# EAGLE schematic SPU (EAGLE 9.6.2), part 1 of 2

## Sheet 1 of 8: Smarfusion2
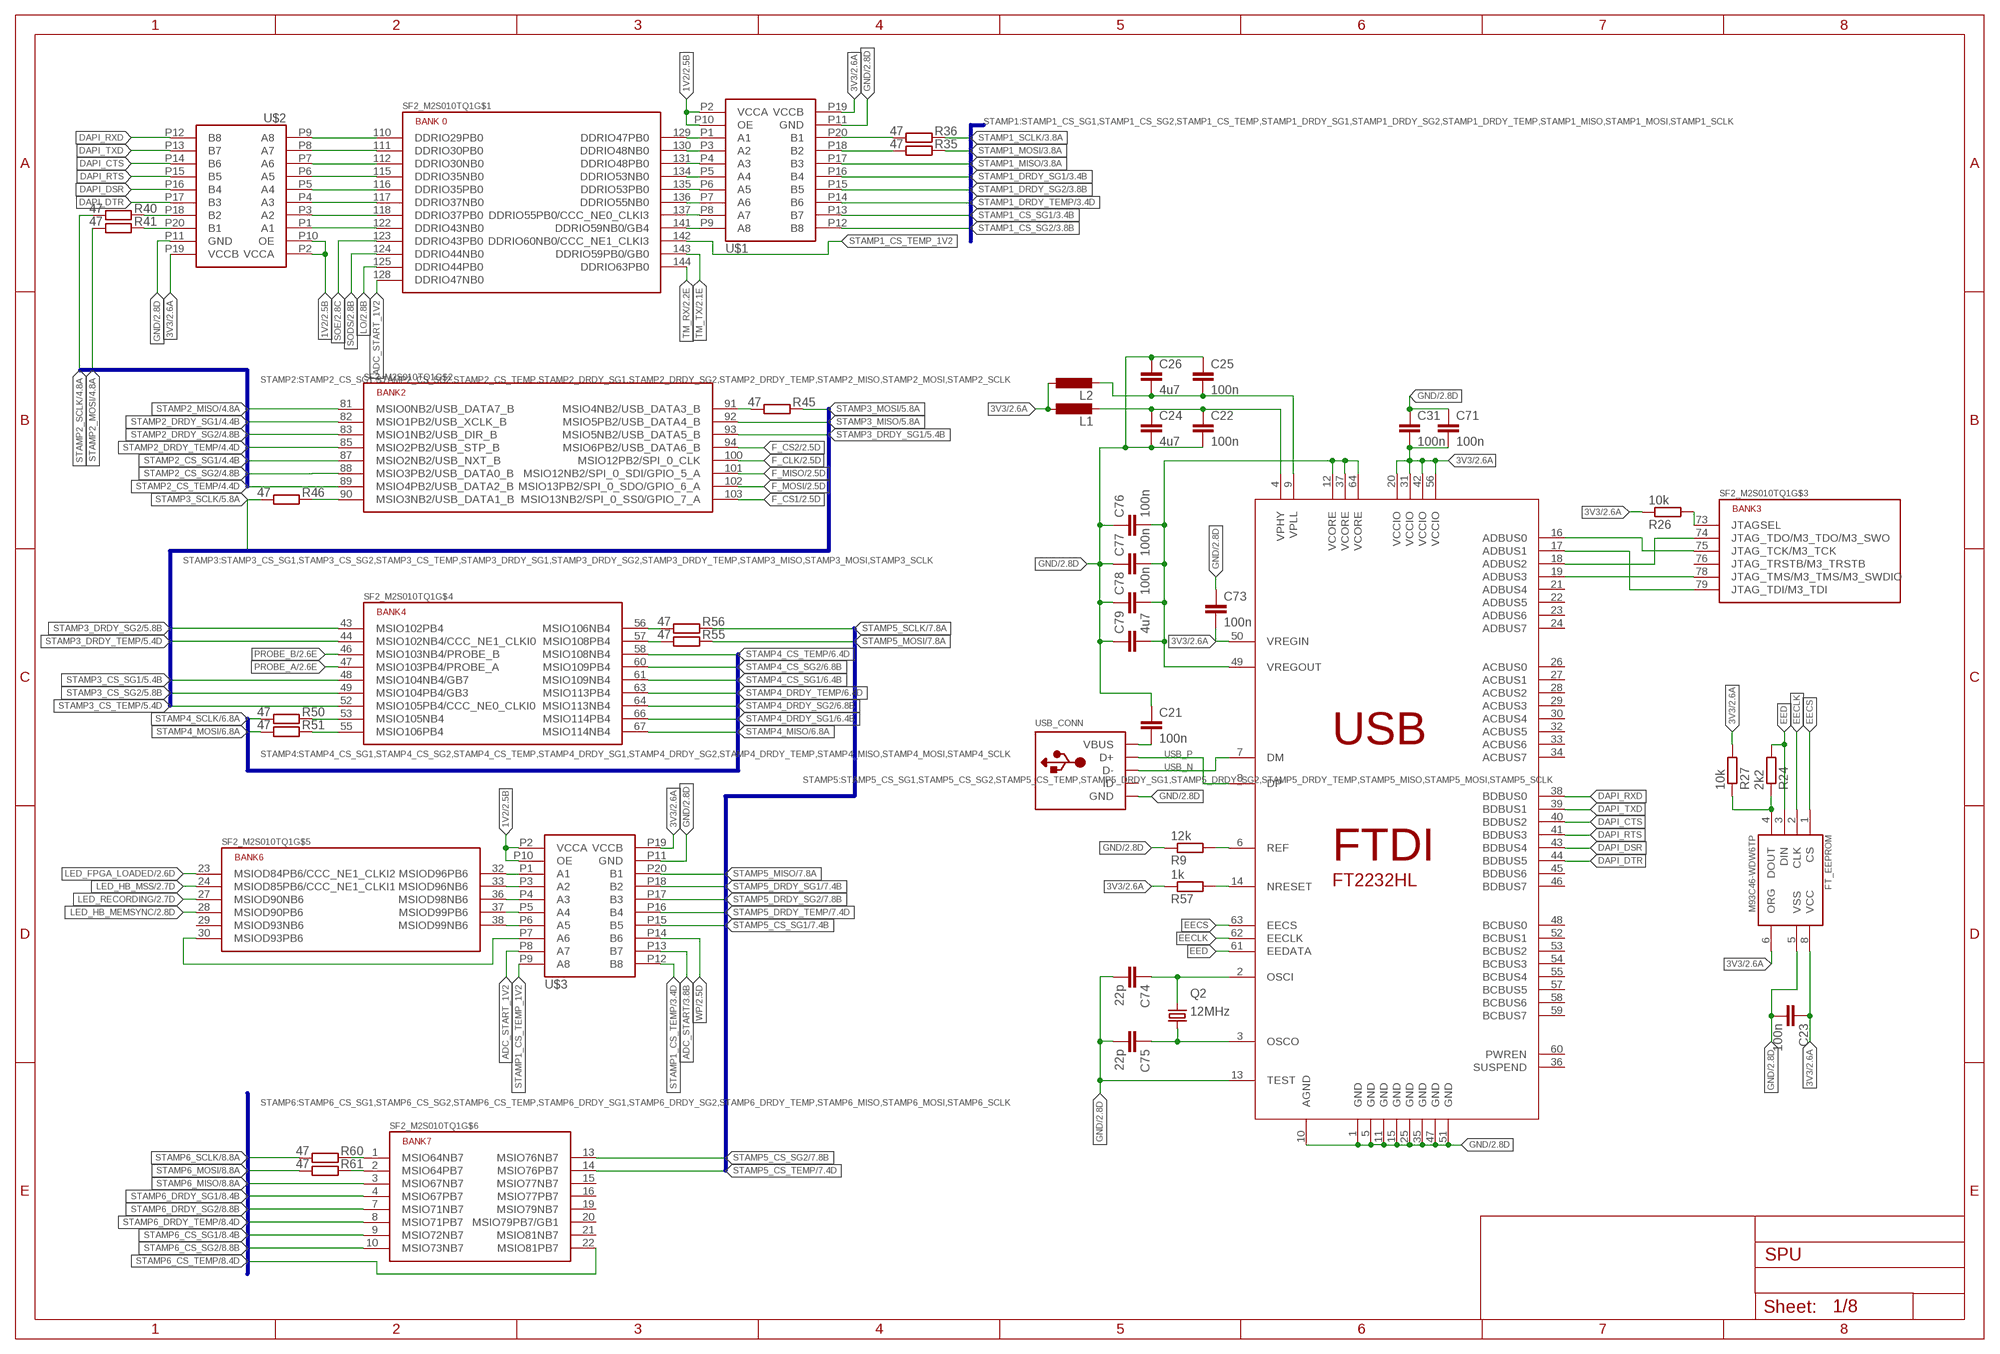
[diagram p0: schematic, sheet 1]

### Parts
C21  100n  C-EUC0805  [C0805]
C22  100n  C-EUC0805  [C0805]
C23  100n  C-EUC0805  [C0805]
C24  4u7  C-EUC0805  [C0805]
C25  100n  C-EUC0805  [C0805]
C26  4u7  C-EUC0805  [C0805]
C31  100n  C-EUC0805  [C0805]
C71  100n  C-EUC0805  [C0805]
C73  100n  C-EUC0805  [C0805]
C74  22p  C-EUC0805  [C0805]
C75  22p  C-EUC0805  [C0805]
C76  100n  C-EUC0805  [C0805]
C77  100n  C-EUC0805  [C0805]
C78  100n  C-EUC0805  [C0805]
C79  4u7  C-EUC0805  [C0805]
FT_EEPROM  M93C46-WDW6TP  [TSSOP-8]
L1  L-EUL1812  [L1812]
L2  L-EUL1812  [L1812]
Q2  12MHz  CRYSTALHC49UP  [HC49UP]
R9  12k  R-EU_R0805  [R0805]
R24  2k2  R-EU_R0805  [R0805]
R26  10k  R-EU_R0805  [R0805]
R27  10k  R-EU_R0805  [R0805]
R35  47  R-EU_R0805  [R0805]
R36  47  R-EU_R0805  [R0805]
R40  47  R-EU_R0805  [R0805]
R41  47  R-EU_R0805  [R0805]
R45  47  R-EU_R0805  [R0805]
R46  47  R-EU_R0805  [R0805]
R50  47  R-EU_R0805  [R0805]
R51  47  R-EU_R0805  [R0805]
R55  47  R-EU_R0805  [R0805]
R56  47  R-EU_R0805  [R0805]
R57  1k  R-EU_R0805  [R0805]
R60  47  R-EU_R0805  [R0805]
R61  47  R-EU_R0805  [R0805]
SF2_M2S010TQ1  SF2_M2S010TQ144  [TQFP144]
U$1  NXB0108PWJ  [TSSOP-20]
U$2  NXB0108PWJ  [TSSOP-20]
U$3  NXB0108PWJ  [TSSOP-20]
USB  FT2232HL  [LQFP64]
USB_CONN  USBMINIB  [USB-MINIB]

### Nets
1V2: U$1.P2(VCCA) U$1.P10(OE) U$2.P2(VCCA) U$2.P10(OE) U$3.P2(VCCA) U$3.P10(OE) ; also sheet 2
3V3: C23.1 C31.2 C71.2 C73.2 FT_EEPROM.6(ORG) FT_EEPROM.8(VCC) L1.1 L2.1 R26.1 R27.2 R57.1 U$1.P19(VCCB) U$2.P19(VCCB) U$3.P19(VCCB) USB.20(VCCIO) USB.31(VCCIO) USB.42(VCCIO) USB.50(VREGIN) USB.56(VCCIO) ; also sheet 2,3,4,5,6,7,8
ADC_START: U$3.P13(B7) ; also sheet 3,4,5,6,7,8
ADC_START_1V2: SF2_M2S010TQ1.128(DDRIO47NB0) U$3.P8(A7)
DAPI_CTS: U$2.P14(B6) USB.40(BDBUS2)
DAPI_DSR: U$2.P16(B4) USB.43(BDBUS4)
DAPI_DTR: U$2.P17(B3) USB.44(BDBUS5)
DAPI_RTS: U$2.P15(B5) USB.41(BDBUS3)
DAPI_RXD: U$2.P12(B8) USB.38(BDBUS0)
DAPI_TXD: U$2.P13(B7) USB.39(BDBUS1)
EECLK: FT_EEPROM.2(CLK) USB.62(EECLK)
EECS: FT_EEPROM.1(CS) USB.63(EECS)
EED: FT_EEPROM.3(DIN) R24.2 USB.61(EEDATA)
F_CLK: SF2_M2S010TQ1.100(MSIO12PB2/SPI_0_CLK) ; also sheet 2
F_CS1: SF2_M2S010TQ1.103(MSIO13NB2/SPI_0_SS0/GPIO_7_A) ; also sheet 2
F_CS2: SF2_M2S010TQ1.94(MSIO6PB2/USB_DATA6_B) ; also sheet 2
F_MISO: SF2_M2S010TQ1.101(MSIO12NB2/SPI_0_SDI/GPIO_5_A) ; also sheet 2
F_MOSI: SF2_M2S010TQ1.102(MSIO13PB2/SPI_0_SDO/GPIO_6_A) ; also sheet 2
GND: C21.1 C22.2 C23.2 C24.2 C25.1 C26.1 C31.1 C71.1 C73.1 C74.2 C75.2 C76.1 C77.1 C78.1 C79.1 FT_EEPROM.5(VSS) R9.1 U$1.P11(GND) U$2.P11(GND) U$3.P11(GND) USB.1(GND) USB.5(GND) USB.10(AGND) USB.11(GND) USB.13(TEST) USB.15(GND) USB.25(GND) USB.35(GND) USB.47(GND) USB.51(GND) USB_CONN.GND ; also sheet 2,3,4,5,6,7,8
LED_FPGA_LOADED: SF2_M2S010TQ1.23(MSIOD84PB6/CCC_NE1_CLKI2) ; also sheet 2
LED_HB_MEMSYNC: SF2_M2S010TQ1.28(MSIOD90PB6) ; also sheet 2
LED_HB_MSS: SF2_M2S010TQ1.24(MSIOD85PB6/CCC_NE1_CLKI1) ; also sheet 2
LED_RECORDING: SF2_M2S010TQ1.27(MSIOD90NB6) ; also sheet 2
LO: SF2_M2S010TQ1.125(DDRIO44PB0) ; also sheet 2
N$10: R26.2 SF2_M2S010TQ1.73(JTAGSEL)
N$11: C74.1 Q2.2 USB.2(OSCI)
N$12: SF2_M2S010TQ1.32(MSIOD96PB6) U$3.P1(A1)
N$13: SF2_M2S010TQ1.33(MSIOD96NB6) U$3.P3(A2)
N$14: SF2_M2S010TQ1.36(MSIOD98NB6) U$3.P4(A3)
N$15: C21.2 USB_CONN.VBUS
N$16: C22.1 C24.1 L1.2 USB.4(VPHY)
N$17: R36.2 U$1.P20(B1)
N$18: SF2_M2S010TQ1.75(JTAG_TCK/M3_TCK) USB.16(ADBUS0)
N$19: SF2_M2S010TQ1.79(JTAG_TDI/M3_TDI) USB.17(ADBUS1)
N$20: SF2_M2S010TQ1.74(JTAG_TDO/M3_TDO/M3_SWO) USB.18(ADBUS2)
N$21: SF2_M2S010TQ1.78(JTAG_TMS/M3_TMS/M3_SWDIO) USB.19(ADBUS3)
N$22: SF2_M2S010TQ1.37(MSIOD99PB6) U$3.P5(A4)
N$23: FT_EEPROM.4(DOUT) R24.1 R27.1
N$28: R35.2 U$1.P18(B2)
N$36: SF2_M2S010TQ1.118(DDRIO37PB0) U$2.P3(A2)
N$42: SF2_M2S010TQ1.122(DDRIO43NB0) U$2.P1(A1)
N$46: R40.1 U$2.P18(B2)
N$47: SF2_M2S010TQ1.129(DDRIO47PB0) U$1.P1(A1)
N$48: R41.1 U$2.P20(B1)
N$49: R46.1 SF2_M2S010TQ1.90(MSIO3NB2/USB_DATA1_B)
N$50: R45.2 SF2_M2S010TQ1.91(MSIO4NB2/USB_DATA3_B)
N$52: SF2_M2S010TQ1.130(DDRIO48NB0) U$1.P3(A2)
N$53: SF2_M2S010TQ1.131(DDRIO48PB0) U$1.P4(A3)
N$54: SF2_M2S010TQ1.134(DDRIO53NB0) U$1.P5(A4)
N$55: SF2_M2S010TQ1.135(DDRIO53PB0) U$1.P6(A5)
N$56: SF2_M2S010TQ1.136(DDRIO55NB0) U$1.P7(A6)
N$57: SF2_M2S010TQ1.137(DDRIO55PB0/CCC_NE0_CLKI3) U$1.P8(A7)
N$58: SF2_M2S010TQ1.141(DDRIO59NB0/GB4) U$1.P9(A8)
N$59: SF2_M2S010TQ1.38(MSIOD99NB6) U$3.P6(A5)
N$60: SF2_M2S010TQ1.110(DDRIO29PB0) U$2.P9(A8)
N$61: SF2_M2S010TQ1.111(DDRIO30PB0) U$2.P8(A7)
N$62: SF2_M2S010TQ1.112(DDRIO30NB0) U$2.P7(A6)
N$63: SF2_M2S010TQ1.115(DDRIO35NB0) U$2.P6(A5)
N$64: R50.1 SF2_M2S010TQ1.53(MSIO105NB4)
N$65: R51.1 SF2_M2S010TQ1.55(MSIO106PB4)
N$66: SF2_M2S010TQ1.116(DDRIO35PB0) U$2.P5(A4)
N$67: SF2_M2S010TQ1.117(DDRIO37NB0) U$2.P4(A3)
N$68: SF2_M2S010TQ1.30(MSIOD93PB6) U$3.P7(A6)
N$69: R55.2 SF2_M2S010TQ1.57(MSIO108PB4)
N$70: R56.2 SF2_M2S010TQ1.56(MSIO106NB4)
N$71: R60.1 SF2_M2S010TQ1.1(MSIO64NB7)
N$72: R61.1 SF2_M2S010TQ1.2(MSIO64PB7)
N$73: R57.2 USB.14(NRESET)
N$74: R9.2 USB.6(REF)
N$75: C75.1 Q2.1 USB.3(OSCO)
N$179: C76.2 C77.2 C78.2 C79.2 USB.12(VCORE) USB.37(VCORE) USB.49(VREGOUT) USB.64(VCORE)
N$180: C25.2 C26.2 L2.2 USB.9(VPLL)
PROBE_A: SF2_M2S010TQ1.47(MSIO103PB4/PROBE_A) ; also sheet 2
PROBE_B: SF2_M2S010TQ1.46(MSIO103NB4/PROBE_B) ; also sheet 2
SODS: SF2_M2S010TQ1.124(DDRIO44NB0) ; also sheet 2
SOE: SF2_M2S010TQ1.123(DDRIO43PB0) ; also sheet 2
STAMP1_CS_SG1: U$1.P13(B7) ; also sheet 3
STAMP1_CS_SG2: U$1.P12(B8) ; also sheet 3
STAMP1_CS_TEMP: U$3.P12(B8) ; also sheet 3
STAMP1_CS_TEMP_1V2: SF2_M2S010TQ1.142(DDRIO60NB0/CCC_NE1_CLKI3) U$3.P9(A8)
STAMP1_DRDY_SG1: U$1.P16(B4) ; also sheet 3
STAMP1_DRDY_SG2: U$1.P15(B5) ; also sheet 3
STAMP1_DRDY_TEMP: U$1.P14(B6) ; also sheet 3
STAMP1_MISO: U$1.P17(B3) ; also sheet 3
STAMP1_MOSI: R35.1 ; also sheet 3
STAMP1_SCLK: R36.1 ; also sheet 3
STAMP2_CS_SG1: SF2_M2S010TQ1.87(MSIO2NB2/USB_NXT_B) ; also sheet 4
STAMP2_CS_SG2: SF2_M2S010TQ1.88(MSIO3PB2/USB_DATA0_B) ; also sheet 4
STAMP2_CS_TEMP: SF2_M2S010TQ1.89(MSIO4PB2/USB_DATA2_B) ; also sheet 4
STAMP2_DRDY_SG1: SF2_M2S010TQ1.82(MSIO1PB2/USB_XCLK_B) ; also sheet 4
STAMP2_DRDY_SG2: SF2_M2S010TQ1.83(MSIO1NB2/USB_DIR_B) ; also sheet 4
STAMP2_DRDY_TEMP: SF2_M2S010TQ1.85(MSIO2PB2/USB_STP_B) ; also sheet 4
STAMP2_MISO: SF2_M2S010TQ1.81(MSIO0NB2/USB_DATA7_B) ; also sheet 4
STAMP2_MOSI: R41.2 ; also sheet 4
STAMP2_SCLK: R40.2 ; also sheet 4
STAMP3_CS_SG1: SF2_M2S010TQ1.48(MSIO104NB4/GB7) ; also sheet 5
STAMP3_CS_SG2: SF2_M2S010TQ1.49(MSIO104PB4/GB3) ; also sheet 5
STAMP3_CS_TEMP: SF2_M2S010TQ1.52(MSIO105PB4/CCC_NE0_CLKI0) ; also sheet 5
STAMP3_DRDY_SG1: SF2_M2S010TQ1.93(MSIO5NB2/USB_DATA5_B) ; also sheet 5
STAMP3_DRDY_SG2: SF2_M2S010TQ1.43(MSIO102PB4) ; also sheet 5
STAMP3_DRDY_TEMP: SF2_M2S010TQ1.44(MSIO102NB4/CCC_NE1_CLKI0) ; also sheet 5
STAMP3_MISO: SF2_M2S010TQ1.92(MSIO5PB2/USB_DATA4_B) ; also sheet 5
STAMP3_MOSI: R45.1 ; also sheet 5
STAMP3_SCLK: R46.2 ; also sheet 5
STAMP4_CS_SG1: SF2_M2S010TQ1.61(MSIO109NB4) ; also sheet 6
STAMP4_CS_SG2: SF2_M2S010TQ1.60(MSIO109PB4) ; also sheet 6
STAMP4_CS_TEMP: SF2_M2S010TQ1.58(MSIO108NB4) ; also sheet 6
STAMP4_DRDY_SG1: SF2_M2S010TQ1.66(MSIO114PB4) ; also sheet 6
STAMP4_DRDY_SG2: SF2_M2S010TQ1.64(MSIO113NB4) ; also sheet 6
STAMP4_DRDY_TEMP: SF2_M2S010TQ1.63(MSIO113PB4) ; also sheet 6
STAMP4_MISO: SF2_M2S010TQ1.67(MSIO114NB4) ; also sheet 6
STAMP4_MOSI: R51.2 ; also sheet 6
STAMP4_SCLK: R50.2 ; also sheet 6
STAMP5_CS_SG1: U$3.P15(B5) ; also sheet 7
STAMP5_CS_SG2: SF2_M2S010TQ1.13(MSIO76NB7) ; also sheet 7
STAMP5_CS_TEMP: SF2_M2S010TQ1.14(MSIO76PB7) ; also sheet 7
STAMP5_DRDY_SG1: U$3.P18(B2) ; also sheet 7
STAMP5_DRDY_SG2: U$3.P17(B3) ; also sheet 7
STAMP5_DRDY_TEMP: U$3.P16(B4) ; also sheet 7
STAMP5_MISO: U$3.P20(B1) ; also sheet 7
STAMP5_MOSI: R55.1 ; also sheet 7
STAMP5_SCLK: R56.1 ; also sheet 7
STAMP6_CS_SG1: SF2_M2S010TQ1.9(MSIO72NB7) ; also sheet 8
STAMP6_CS_SG2: SF2_M2S010TQ1.10(MSIO73NB7) ; also sheet 8
STAMP6_CS_TEMP: SF2_M2S010TQ1.22(MSIO81PB7) ; also sheet 8
STAMP6_DRDY_SG1: SF2_M2S010TQ1.4(MSIO67PB7) ; also sheet 8
STAMP6_DRDY_SG2: SF2_M2S010TQ1.7(MSIO71NB7) ; also sheet 8
STAMP6_DRDY_TEMP: SF2_M2S010TQ1.8(MSIO71PB7) ; also sheet 8
STAMP6_MISO: SF2_M2S010TQ1.3(MSIO67NB7) ; also sheet 8
STAMP6_MOSI: R61.2 ; also sheet 8
STAMP6_SCLK: R60.2 ; also sheet 8
TM_RX: SF2_M2S010TQ1.144(DDRIO63PB0) ; also sheet 2
TM_TX: SF2_M2S010TQ1.143(DDRIO59PB0/GB0) ; also sheet 2
USB_N: USB.7(DM) USB_CONN.D-
USB_P: USB.8(DP) USB_CONN.D+
WP: U$3.P14(B6) ; also sheet 2
Unconnected: SF2_M2S010TQ1.15(MSIO77NB7) SF2_M2S010TQ1.16(MSIO77PB7) SF2_M2S010TQ1.19(MSIO79NB7) SF2_M2S010TQ1.20(MSIO79PB7/GB1) SF2_M2S010TQ1.21(MSIO81NB7) SF2_M2S010TQ1.29(MSIOD93NB6) SF2_M2S010TQ1.76(JTAG_TRSTB/M3_TRSTB) USB.21(ADBUS4) USB.22(ADBUS5) USB.23(ADBUS6) USB.24(ADBUS7) USB.26(ACBUS0) USB.27(ACBUS1) USB.28(ACBUS2) USB.29(ACBUS3) USB.30(ACBUS4) USB.32(ACBUS5) USB.33(ACBUS6) USB.34(ACBUS7) USB.36(SUSPEND) USB.45(BDBUS6) USB.46(BDBUS7) USB.48(BCBUS0) USB.52(BCBUS1) USB.53(BCBUS2) USB.54(BCBUS3) USB.55(BCBUS4) USB.57(BCBUS5) USB.58(BCBUS6) USB.59(BCBUS7) USB.60(PWREN) USB_CONN.ID

### Buses
STAMP1:STAMP1_CS_SG1,STAMP1_CS_SG2,STAMP1_CS_TEMP,STAMP1_DRDY_SG1,STAMP1_DRDY_SG2,STAMP1_DRDY_TEMP,STAMP1_MISO,STAMP1_MOSI,STAMP1_SCLK
STAMP2:STAMP2_CS_SG1,STAMP2_CS_SG2,STAMP2_CS_TEMP,STAMP2_DRDY_SG1,STAMP2_DRDY_SG2,STAMP2_DRDY_TEMP,STAMP2_MISO,STAMP2_MOSI,STAMP2_SCLK
STAMP3:STAMP3_CS_SG1,STAMP3_CS_SG2,STAMP3_CS_TEMP,STAMP3_DRDY_SG1,STAMP3_DRDY_SG2,STAMP3_DRDY_TEMP,STAMP3_MISO,STAMP3_MOSI,STAMP3_SCLK
STAMP4:STAMP4_CS_SG1,STAMP4_CS_SG2,STAMP4_CS_TEMP,STAMP4_DRDY_SG1,STAMP4_DRDY_SG2,STAMP4_DRDY_TEMP,STAMP4_MISO,STAMP4_MOSI,STAMP4_SCLK
STAMP5:STAMP5_CS_SG1,STAMP5_CS_SG2,STAMP5_CS_TEMP,STAMP5_DRDY_SG1,STAMP5_DRDY_SG2,STAMP5_DRDY_TEMP,STAMP5_MISO,STAMP5_MOSI,STAMP5_SCLK
STAMP6:STAMP6_CS_SG1,STAMP6_CS_SG2,STAMP6_CS_TEMP,STAMP6_DRDY_SG1,STAMP6_DRDY_SG2,STAMP6_DRDY_TEMP,STAMP6_MISO,STAMP6_MOSI,STAMP6_SCLK

## Sheet 2 of 8: Interfaces
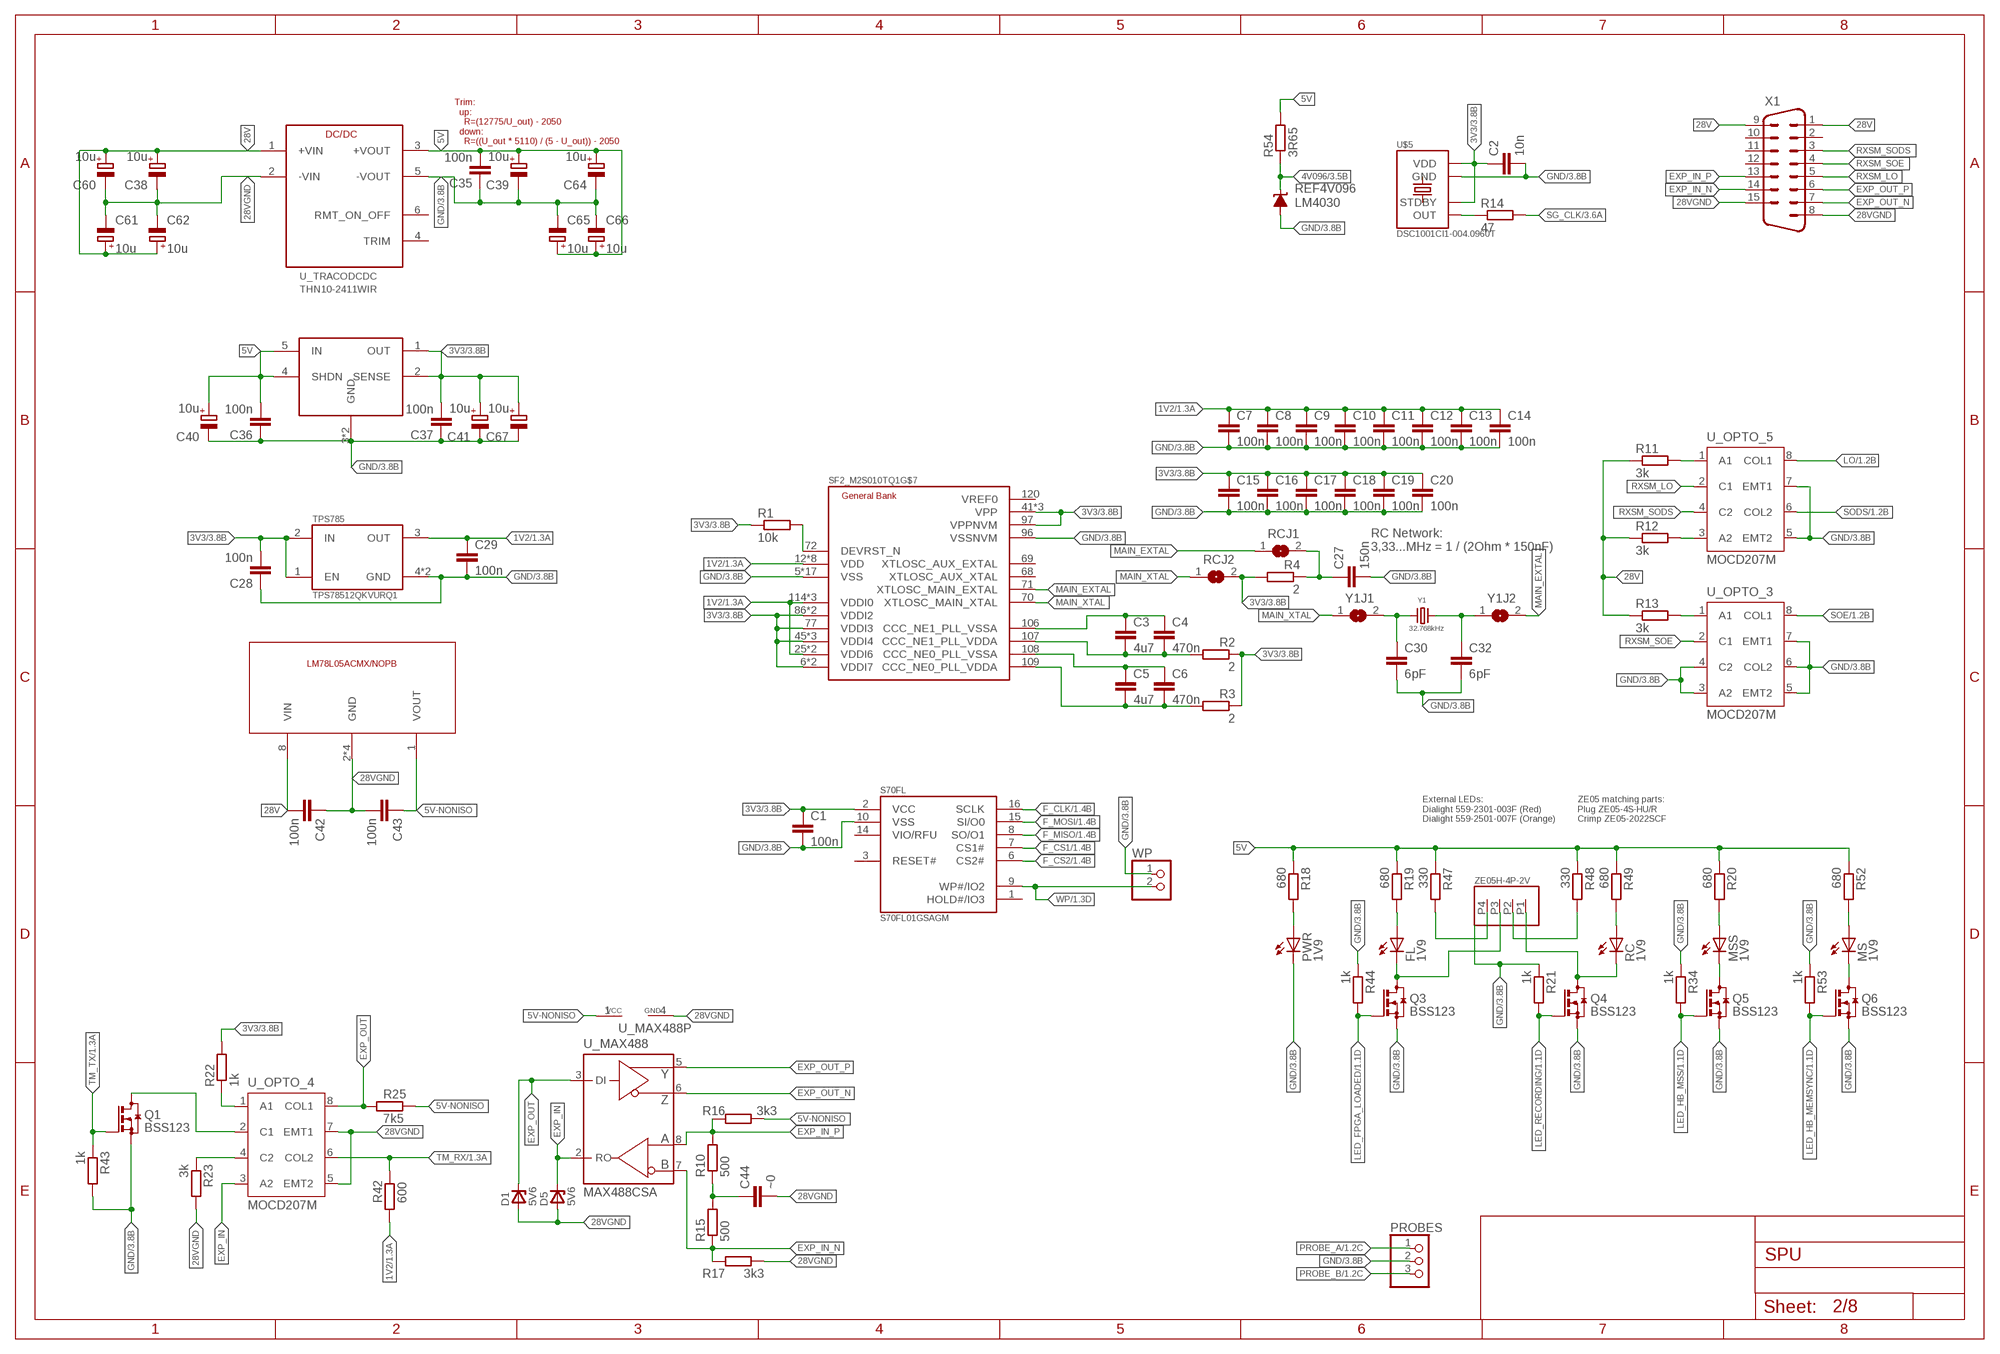
[diagram p1: schematic, sheet 2]

### Parts
C1  100n  C-EUC0805  [C0805]
C2  10n  C-EUC0805  [C0805]
C3  4u7  C-EUC0805  [C0805]
C4  470n  C-EUC0805  [C0805]
C5  4u7  C-EUC0805  [C0805]
C6  470n  C-EUC0805  [C0805]
C7  100n  C-EUC0805  [C0805]
C8  100n  C-EUC0805  [C0805]
C9  100n  C-EUC0805  [C0805]
C10  100n  C-EUC0805  [C0805]
C11  100n  C-EUC0805  [C0805]
C12  100n  C-EUC0805  [C0805]
C13  100n  C-EUC0805  [C0805]
C14  100n  C-EUC0805  [C0805]
C15  100n  C-EUC0805  [C0805]
C16  100n  C-EUC0805  [C0805]
C17  100n  C-EUC0805  [C0805]
C18  100n  C-EUC0805  [C0805]
C19  100n  C-EUC0805  [C0805]
C20  100n  C-EUC0805  [C0805]
C27  150n  C-EUC0805  [C0805]
C28  100n  C-EUC0805  [C0805]
C29  100n  C-EUC0805  [C0805]
C30  6pF  C-EUC0805  [C0805]
C32  6pF  C-EUC0805  [C0805]
C35  100n  C-EUC0805  [C0805]
C36  100n  C-EUC0805  [C0805]
C37  100n  C-EUC0805  [C0805]
C38  10u  CPOL-EUE/7260-38W  [E/7260-38W]
C39  10u  CPOL-EUE/7260-38W  [E/7260-38W]
C40  10u  CPOL-EUE/7260-38W  [E/7260-38W]
C41  10u  CPOL-EUE/7260-38W  [E/7260-38W]
C42  100n  C-EUC1206  [C1206]
C43  100n  C-EUC0805  [C0805]
C44  ~0  C-EUC0805  [C0805]
C60  10u  CPOL-EUE/7260-38W  [E/7260-38W]
C61  10u  CPOL-EUE/7260-38W  [E/7260-38W]
C62  10u  CPOL-EUE/7260-38W  [E/7260-38W]
C64  10u  CPOL-EUE/7260-38W  [E/7260-38W]
C65  10u  CPOL-EUE/7260-38W  [E/7260-38W]
C66  10u  CPOL-EUE/7260-38W  [E/7260-38W]
C67  10u  CPOL-EUE/7260-38W  [E/7260-38W]
D1  5V6  DZMELF  [DMELF]
D5  5V6  DZMELF  [DMELF]
FL  1V9  LEDCHIP-LED0805  [CHIP-LED0805]
MS  1V9  LEDCHIP-LED0805  [CHIP-LED0805]
MSS  1V9  LEDCHIP-LED0805  [CHIP-LED0805]
PROBES  PSS254_G3  [PSS254_G3]
PWR  1V9  LEDCHIP-LED0805  [CHIP-LED0805]
Q1  BSS123  [SOT23]
Q3  BSS123  [SOT23]
Q4  BSS123  [SOT23]
Q5  BSS123  [SOT23]
Q6  BSS123  [SOT23]
R1  10k  R-EU_R0805  [R0805]
R2  2  R-EU_R0805  [R0805]
R3  2  R-EU_R0805  [R0805]
R4  2  R-EU_R0805  [R0805]
R10  500  R-EU_R0805  [R0805]
R11  3k  R-EU_R0805  [R0805]
R12  3k  R-EU_R0805  [R0805]
R13  3k  R-EU_R0805  [R0805]
R14  47  R-EU_R0805  [R0805]
R15  500  R-EU_R0805  [R0805]
R16  3k3  R-EU_R0805  [R0805]
R17  3k3  R-EU_R0805  [R0805]
R18  680  R-EU_R0805  [R0805]
R19  680  R-EU_R0805  [R0805]
R20  680  R-EU_R0805  [R0805]
R21  1k  R-EU_R0805  [R0805]
R22  1k  R-EU_R0805  [R0805]
R23  3k  R-EU_R0805  [R0805]
R25  7k5  R-EU_R0805  [R0805]
R34  1k  R-EU_R0805  [R0805]
R42  600  R-EU_R0805  [R0805]
R43  1k  R-EU_R0805  [R0805]
R44  1k  R-EU_R0805  [R0805]
R47  330  R-EU_R0805  [R0805]
R48  330  R-EU_R0805  [R0805]
R49  680  R-EU_R0805  [R0805]
R52  680  R-EU_R0805  [R0805]
R53  1k  R-EU_R0805  [R0805]
R54  3R65  R-EU_R0805  [R0805]
RC  1V9  LEDCHIP-LED0805  [CHIP-LED0805]
RCJ1  SJ  [SJ]
RCJ2  SJ  [SJ]
REF4V096  LM4030  [SOT-23]
S70FL  S70FL01GSAGM  [SOIC16]
TPS78512QKVURQ1  TPS785  [TO-252-5]
U$5  DSC1001CI1-004.0960T  [CDFN3225]
U_7805  LM78L05ACMX/NOPB  [SOIC8]
U_LT1528  LT1528  [Q5-DD]
U_MAX488  MAX488CSA  [SO08]
U_OPTO_3  MOCD207M  MOCD207M_SOIC8  [SOIC127P594X363-8N]
U_OPTO_4  MOCD207M  MOCD207M_SOIC8  [SOIC127P594X363-8N]
U_OPTO_5  MOCD207M  MOCD207M_SOIC8  [SOIC127P594X363-8N]
U_TRACODCDC  THN10-2411WIR  THL_20WI_SERIES  [THL_20WI_SERIES]
WP  PSS254_G2  [PSS254_G2]
X1  M15H  [M15H]
Y1  32.768kHz  WE-XTAL_IQXC-90_830107088501  [WE-XTAL_IQXC-90]
Y1J1  SJ  [SJ]
Y1J2  SJ  [SJ]
ZE05H-4P-2V  ZE05-4P-2V  [ZE05H-4P-2V]

### Nets
1V2: C7.1 C8.1 C9.1 C10.1 C11.1 C12.1 C13.1 C14.1 C29.1 R42.1 SF2_M2S010TQ1.12(VDD) SF2_M2S010TQ1.25(VDDI6) SF2_M2S010TQ1.31(VDD) SF2_M2S010TQ1.35(VDDI6) SF2_M2S010TQ1.39(VDD) SF2_M2S010TQ1.50(VDD) SF2_M2S010TQ1.95(VDD) SF2_M2S010TQ1.105(VDD) SF2_M2S010TQ1.114(VDDI0) SF2_M2S010TQ1.121(VDD) SF2_M2S010TQ1.127(VDDI0) SF2_M2S010TQ1.133(VDD) SF2_M2S010TQ1.138(VDDI0) TPS78512QKVURQ1.3(OUT) ; also sheet 1
3V3: C1.1 C2.1 C15.1 C16.1 C17.1 C18.1 C19.1 C20.1 C28.2 C37.2 C41.+ C67.+ R1.1 R2.1 R3.1 R4.2 R22.2 RCJ2.2 S70FL.2(VCC) SF2_M2S010TQ1.6(VDDI7) SF2_M2S010TQ1.17(VDDI7) SF2_M2S010TQ1.41(VPP) SF2_M2S010TQ1.45(VDDI4) SF2_M2S010TQ1.54(VDDI4) SF2_M2S010TQ1.62(VDDI4) SF2_M2S010TQ1.77(VDDI3) SF2_M2S010TQ1.80(VPP) SF2_M2S010TQ1.86(VDDI2) SF2_M2S010TQ1.97(VPPNVM) SF2_M2S010TQ1.99(VDDI2) SF2_M2S010TQ1.104(VPP) TPS78512QKVURQ1.1(EN) TPS78512QKVURQ1.2(IN) U$5.P1(STDBY) U$5.P4(VDD) U_LT1528.1(OUT) U_LT1528.2(SENSE) ; also sheet 1,3,4,5,6,7,8
4V096: R54.1 REF4V096.P4(C) ; also sheet 3,4,5,6,7,8
5V [5v]: C35.2 C36.2 C39.+ C40.+ C64.+ C65.+ C66.+ R18.1 R19.1 R20.1 R47.1 R48.1 R49.1 R52.1 R54.2 U_LT1528.4(SHDN) U_LT1528.5(IN) U_TRACODCDC.3(+VOUT)
5V-NONISO [5v]: C43.1 R16.1 R25.2 U_7805.1(VOUT) U_MAX488.1(VCC)
28V [28vClearExcept]: C38.+ C42.2 C60.+ C61.+ C62.+ R11.1 R12.1 R13.1 U_7805.8(VIN) U_TRACODCDC.1(+VIN) X1.1 X1.9
28VGND [28vClearExcept]: C38.- C42.1 C43.2 C44.2 C60.- C61.- C62.- D1.A D5.A R17.1 R23.2 U_7805.2(GND) U_7805.3(GND) U_7805.6(GND) U_7805.7(GND) U_MAX488.4(GND) U_OPTO_4.5(EMT2) U_OPTO_4.7(EMT1) U_TRACODCDC.2(-VIN) X1.8 X1.15
EXP_IN: D5.C U_MAX488.2(RO) U_OPTO_4.3(A2)
EXP_IN_N [28vClearExcept]: R15.1 R17.2 U_MAX488.7(B) X1.14
EXP_IN_P [28vClearExcept]: R10.2 R16.2 U_MAX488.8(A) X1.13
EXP_OUT: D1.C R25.1 U_MAX488.3(DI) U_OPTO_4.8(COL1)
EXP_OUT_N [28vClearExcept]: U_MAX488.6(Z) X1.7
EXP_OUT_P [28vClearExcept]: U_MAX488.5(Y) X1.6
F_CLK: S70FL.16(SCLK) ; also sheet 1
F_CS1: S70FL.7(CS1#) ; also sheet 1
F_CS2: S70FL.6(CS2#) ; also sheet 1
F_MISO: S70FL.8(SO/O1) ; also sheet 1
F_MOSI: S70FL.15(SI/O0) ; also sheet 1
GND: C1.2 C2.2 C7.2 C8.2 C9.2 C10.2 C11.2 C12.2 C13.2 C14.2 C15.2 C16.2 C17.2 C18.2 C19.2 C20.2 C27.2 C28.1 C29.2 C30.2 C32.2 C35.1 C36.1 C37.1 C39.- C40.- C41.- C64.- C65.- C66.- C67.- PROBES.2 PWR.C Q1.2(S) Q3.2(S) Q4.2(S) Q5.2(S) Q6.2(S) R21.1 R34.1 R43.2 R44.1 R53.1 REF4V096.P5(A) S70FL.10(VSS) SF2_M2S010TQ1.5(VSS) SF2_M2S010TQ1.11(VSS) SF2_M2S010TQ1.18(VSS) SF2_M2S010TQ1.26(VSS) SF2_M2S010TQ1.34(VSS) SF2_M2S010TQ1.40(VSS) SF2_M2S010TQ1.42(VSS) SF2_M2S010TQ1.51(VSS) SF2_M2S010TQ1.59(VSS) SF2_M2S010TQ1.65(VSS) SF2_M2S010TQ1.84(VSS) SF2_M2S010TQ1.96(VSSNVM) SF2_M2S010TQ1.98(VSS) SF2_M2S010TQ1.113(VSS) SF2_M2S010TQ1.119(VSS) SF2_M2S010TQ1.126(VSS) SF2_M2S010TQ1.132(VSS) SF2_M2S010TQ1.139(VSS) TPS78512QKVURQ1.4(GND) TPS78512QKVURQ1.5(GND) U$5.P2(GND) U_LT1528.3(GND) U_LT1528.6(GND) U_OPTO_3.3(A2) U_OPTO_3.4(C2) U_OPTO_3.5(EMT2) U_OPTO_3.6(COL2) U_OPTO_3.7(EMT1) U_OPTO_5.5(EMT2) U_OPTO_5.7(EMT1) U_TRACODCDC.5(-VOUT) WP.1 ZE05H-4P-2V.P5 ZE05H-4P-2V.P6 ; also sheet 1,3,4,5,6,7,8
LED_FPGA_LOADED: Q3.1(G) R44.2 ; also sheet 1
LED_HB_MEMSYNC: Q6.1(G) R53.2 ; also sheet 1
LED_HB_MSS: Q5.1(G) R34.2 ; also sheet 1
LED_RECORDING: Q4.1(G) R21.2 ; also sheet 1
LO: U_OPTO_5.8(COL1) ; also sheet 1
MAIN_EXTAL: RCJ1.1 SF2_M2S010TQ1.71(XTLOSC_MAIN_EXTAL) Y1J2.2
MAIN_XTAL: RCJ2.1 SF2_M2S010TQ1.70(XTLOSC_MAIN_XTAL) Y1J1.1
N$1 [28vClearExcept]: C44.1 R10.1 R15.2
N$2: R1.2 SF2_M2S010TQ1.72(DEVRST_N)
N$3: R23.1 U_OPTO_4.4(C2)
N$4: C3.1 C4.1 SF2_M2S010TQ1.106(CCC_NE1_PLL_VSSA)
N$5: C3.2 C4.2 R2.2 SF2_M2S010TQ1.107(CCC_NE1_PLL_VDDA)
N$6: C5.2 C6.2 R3.2 SF2_M2S010TQ1.109(CCC_NE0_PLL_VDDA)
N$7: C5.1 C6.1 SF2_M2S010TQ1.108(CCC_NE0_PLL_VSSA)
N$8: C30.1 Y1.1 Y1J1.2
N$24: R13.2 U_OPTO_3.1(A1)
N$25: R12.2 U_OPTO_5.3(A2)
N$26: R11.2 U_OPTO_5.1(A1)
N$27: R22.1 U_OPTO_4.1(A1)
N$29: R14.1 U$5.P3(OUT)
N$30: PWR.A R18.2
N$31: MS.C Q6.3(D)
N$32: MSS.C Q5.3(D)
N$44: Q1.3(D) U_OPTO_4.2(C1)
N$45: FL.A R19.2
N$51: MSS.A R20.2
N$76: C32.1 Y1.2 Y1J2.1
N$77: MS.A R52.2
N$175: R49.2 RC.A
N$176: R47.2 ZE05H-4P-2V.P4
N$177: Q4.3(D) RC.C ZE05H-4P-2V.P1
N$178: R48.2 ZE05H-4P-2V.P2
N$181: FL.C Q3.3(D) ZE05H-4P-2V.P3
NET_U: C27.1 R4.1 RCJ1.2
PROBE_A: PROBES.1 ; also sheet 1
PROBE_B: PROBES.3 ; also sheet 1
RXSM_LO [5v]: U_OPTO_5.2(C1) X1.5
RXSM_SODS [5v]: U_OPTO_5.4(C2) X1.3
RXSM_SOE [5v]: U_OPTO_3.2(C1) X1.4
SG_CLK: R14.2 ; also sheet 3,4,5,6,7,8
SODS: U_OPTO_5.6(COL2) ; also sheet 1
SOE: U_OPTO_3.8(COL1) ; also sheet 1
TM_RX: R42.2 U_OPTO_4.6(COL2) ; also sheet 1
TM_TX: Q1.1(G) R43.1 ; also sheet 1
WP: S70FL.9(WP#/IO2) WP.2 ; also sheet 1
Unconnected: S70FL.1(HOLD#/IO3) S70FL.3(RESET#) S70FL.14(VIO/RFU) SF2_M2S010TQ1.68(XTLOSC_AUX_XTAL) SF2_M2S010TQ1.69(XTLOSC_AUX_EXTAL) SF2_M2S010TQ1.120(VREF0) U_TRACODCDC.4(TRIM) U_TRACODCDC.6(RMT_ON_OFF) X1.2 X1.10 X1.11 X1.12

### Notes on the sheet
- Trim:
    up:
      R=(12775/U_out) - 2050
    down:
      R=((U_out * 5110) / (5 - U_out)) - 2050
- RC Network:
  3,33...MHz = 1 / (2Ohm * 150nF)
- LM78L05ACMX/NOPB
- External LEDs:
  Dialight 559-2301-003F (Red)
  Dialight 559-2501-007F (Orange)
- ZE05 matching parts:
  Plug ZE05-4S-HU/R
  Crimp ZE05-2022SCF

## Sheet 3 of 8: STAMP 1
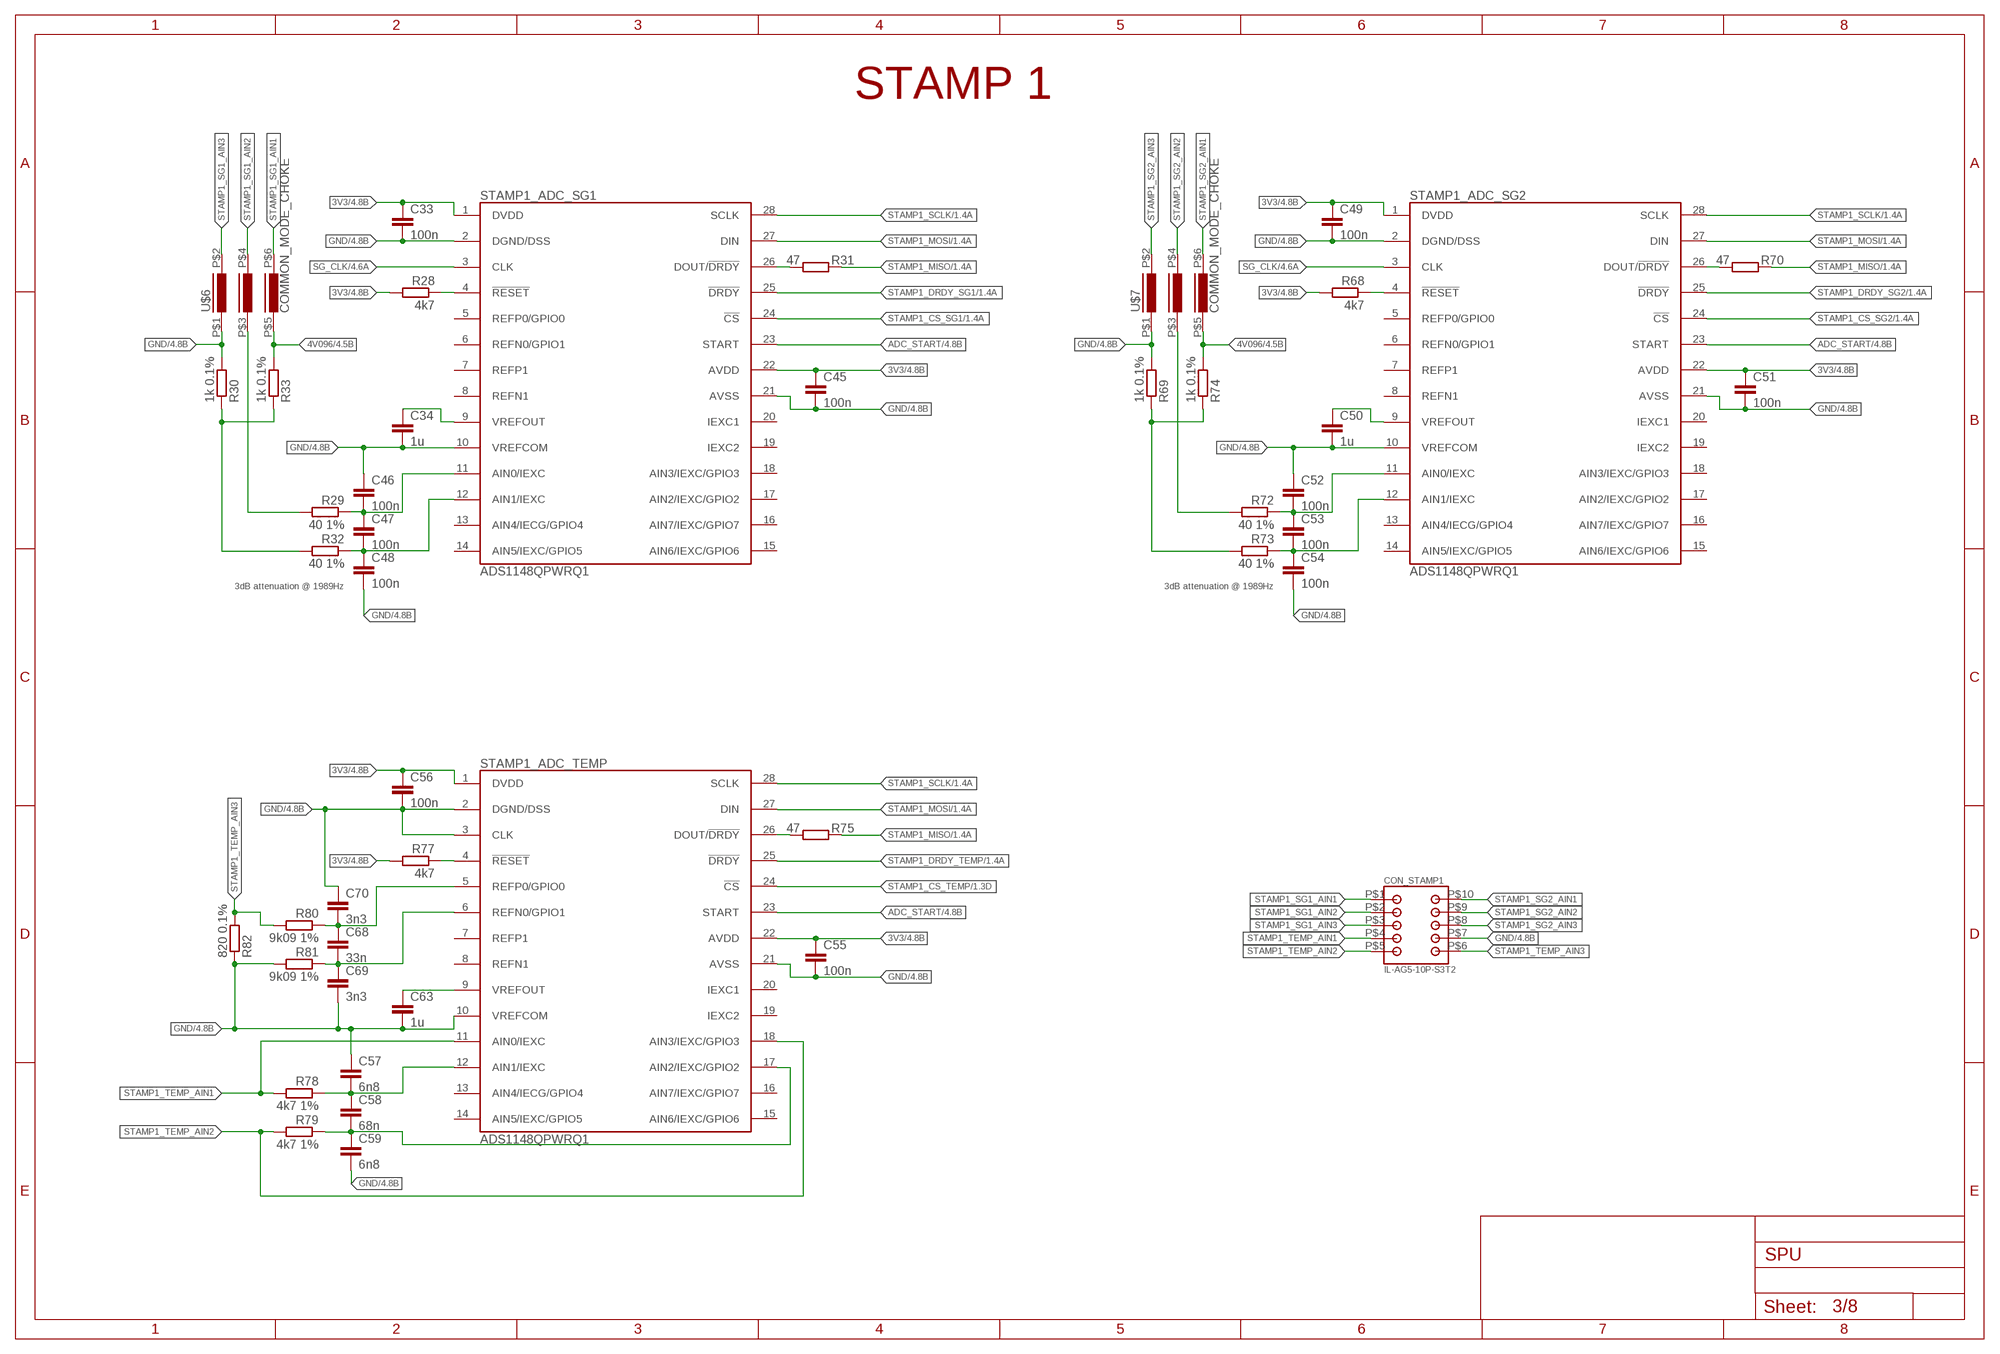
[diagram p2: schematic, sheet 3]

### Parts
C33  100n  C-EUC0805  [C0805]
C34  1u  C-EUC0805  [C0805]
C45  100n  C-EUC0805  [C0805]
C46  100n  C-EUC0805  [C0805]
C47  100n  C-EUC0805  [C0805]
C48  100n  C-EUC0805  [C0805]
C49  100n  C-EUC0805  [C0805]
C50  1u  C-EUC0805  [C0805]
C51  100n  C-EUC0805  [C0805]
C52  100n  C-EUC0805  [C0805]
C53  100n  C-EUC0805  [C0805]
C54  100n  C-EUC0805  [C0805]
C55  100n  C-EUC0805  [C0805]
C56  100n  C-EUC0805  [C0805]
C57  6n8  C-EUC0805  [C0805]
C58  68n  C-EUC0805  [C0805]
C59  6n8  C-EUC0805  [C0805]
C63  1u  C-EUC0805  [C0805]
C68  33n  C-EUC0805  [C0805]
C69  3n3  C-EUC0805  [C0805]
C70  3n3  C-EUC0805  [C0805]
CON_STAMP1  IL-AG5-10P-S3T2  [IL-AG5-10P-S3T2]
R28  4k7  R-EU_R0805  [R0805]
R29  40 1%  R-EU_R0805  [R0805]
R30  1k 0.1%  R-EU_R0805  [R0805]
R31  47  R-EU_R0805  [R0805]
R32  40 1%  R-EU_R0805  [R0805]
R33  1k 0.1%  R-EU_R0805  [R0805]
R68  4k7  R-EU_R0805  [R0805]
R69  1k 0.1%  R-EU_R0805  [R0805]
R70  47  R-EU_R0805  [R0805]
R72  40 1%  R-EU_R0805  [R0805]
R73  40 1%  R-EU_R0805  [R0805]
R74  1k 0.1%  R-EU_R0805  [R0805]
R75  47  R-EU_R0805  [R0805]
R77  4k7  R-EU_R0805  [R0805]
R78  4k7 1%  R-EU_R0805  [R0805]
R79  4k7 1%  R-EU_R0805  [R0805]
R80  9k09 1%  R-EU_R0805  [R0805]
R81  9k09 1%  R-EU_R0805  [R0805]
R82  820 0.1%  R-EU_R0805  [R0805]
STAMP1_ADC_SG1  ADS1148QPWRQ1  [TSSOP28]
STAMP1_ADC_SG2  ADS1148QPWRQ1  [TSSOP28]
STAMP1_ADC_TEMP  ADS1148QPWRQ1  [TSSOP28]
U$6  COMMON_MODE_CHOKE  [COMMON_MODE_CHOKE]
U$7  COMMON_MODE_CHOKE  [COMMON_MODE_CHOKE]

### Nets
3V3: C33.1 C45.1 C49.1 C51.1 C55.1 C56.1 R28.2 R68.2 R77.2 STAMP1_ADC_SG1.1(DVDD) STAMP1_ADC_SG1.22(AVDD) STAMP1_ADC_SG2.1(DVDD) STAMP1_ADC_SG2.22(AVDD) STAMP1_ADC_TEMP.1(DVDD) STAMP1_ADC_TEMP.22(AVDD) ; also sheet 1,2,4,5,6,7,8
4V096: R33.2 R74.2 U$6.P$5 U$7.P$5 ; also sheet 2,4,5,6,7,8
ADC_START: STAMP1_ADC_SG1.23(START) STAMP1_ADC_SG2.23(START) STAMP1_ADC_TEMP.23(START) ; also sheet 1,4,5,6,7,8
GND: C33.2 C34.2 C45.2 C46.1 C48.2 C49.2 C50.2 C51.2 C52.1 C54.2 C55.2 C56.2 C57.1 C59.2 C63.2 C69.2 C70.1 CON_STAMP1.P$7 R30.2 R69.2 R81.2 R82.1 STAMP1_ADC_SG1.2(DGND/DSS) STAMP1_ADC_SG1.10(VREFCOM) STAMP1_ADC_SG1.21(AVSS) STAMP1_ADC_SG2.2(DGND/DSS) STAMP1_ADC_SG2.10(VREFCOM) STAMP1_ADC_SG2.21(AVSS) STAMP1_ADC_TEMP.2(DGND/DSS) STAMP1_ADC_TEMP.3(CLK) STAMP1_ADC_TEMP.10(VREFCOM) STAMP1_ADC_TEMP.21(AVSS) U$6.P$1 U$7.P$1 ; also sheet 1,2,4,5,6,7,8
N$34: C34.1 STAMP1_ADC_SG1.9(VREFOUT)
N$35: R68.1 STAMP1_ADC_SG2.4(!RESET)
N$37: R28.1 STAMP1_ADC_SG1.4(!RESET)
N$38: R31.2 STAMP1_ADC_SG1.26(DOUT/!DRDY)
N$39: C46.2 C47.1 R29.1 STAMP1_ADC_SG1.11(AIN0/IEXC)
N$40: C47.2 C48.1 R32.1 STAMP1_ADC_SG1.12(AIN1/IEXC)
N$41: C50.1 STAMP1_ADC_SG2.9(VREFOUT)
N$43: R70.2 STAMP1_ADC_SG2.26(DOUT/!DRDY)
N$79: C52.2 C53.1 R72.1 STAMP1_ADC_SG2.11(AIN0/IEXC)
N$80: C53.2 C54.1 R73.1 STAMP1_ADC_SG2.12(AIN1/IEXC)
N$81: R30.1 R32.2 R33.1
N$82: R69.1 R73.2 R74.1
N$83: R29.2 U$6.P$3
N$84: R72.2 U$7.P$3
N$86: R75.2 STAMP1_ADC_TEMP.26(DOUT/!DRDY)
N$87: R77.1 STAMP1_ADC_TEMP.4(!RESET)
N$88: C57.2 C58.1 R78.1 STAMP1_ADC_TEMP.12(AIN1/IEXC)
N$89: C58.2 C59.1 R79.1 STAMP1_ADC_TEMP.17(AIN2/IEXC/GPIO2)
N$90: C63.1 STAMP1_ADC_TEMP.9(VREFOUT)
N$91: C68.2 C69.1 R81.1 STAMP1_ADC_TEMP.6(REFN0/GPIO1)
N$92: C68.1 C70.2 R80.1 STAMP1_ADC_TEMP.5(REFP0/GPIO0)
SG_CLK: STAMP1_ADC_SG1.3(CLK) STAMP1_ADC_SG2.3(CLK) ; also sheet 2,4,5,6,7,8
STAMP1_CS_SG1: STAMP1_ADC_SG1.24(!CS) ; also sheet 1
STAMP1_CS_SG2: STAMP1_ADC_SG2.24(!CS) ; also sheet 1
STAMP1_CS_TEMP: STAMP1_ADC_TEMP.24(!CS) ; also sheet 1
STAMP1_DRDY_SG1: STAMP1_ADC_SG1.25(!DRDY) ; also sheet 1
STAMP1_DRDY_SG2: STAMP1_ADC_SG2.25(!DRDY) ; also sheet 1
STAMP1_DRDY_TEMP: STAMP1_ADC_TEMP.25(!DRDY) ; also sheet 1
STAMP1_MISO: R31.1 R70.1 R75.1 ; also sheet 1
STAMP1_MOSI: STAMP1_ADC_SG1.27(DIN) STAMP1_ADC_SG2.27(DIN) STAMP1_ADC_TEMP.27(DIN) ; also sheet 1
STAMP1_SCLK: STAMP1_ADC_SG1.28(SCLK) STAMP1_ADC_SG2.28(SCLK) STAMP1_ADC_TEMP.28(SCLK) ; also sheet 1
STAMP1_SG1_AIN1: CON_STAMP1.P$1 U$6.P$6
STAMP1_SG1_AIN2: CON_STAMP1.P$2 U$6.P$4
STAMP1_SG1_AIN3: CON_STAMP1.P$3 U$6.P$2
STAMP1_SG2_AIN1: CON_STAMP1.P$10 U$7.P$6
STAMP1_SG2_AIN2: CON_STAMP1.P$9 U$7.P$4
STAMP1_SG2_AIN3: CON_STAMP1.P$8 U$7.P$2
STAMP1_TEMP_AIN1: CON_STAMP1.P$4 R78.2 STAMP1_ADC_TEMP.11(AIN0/IEXC)
STAMP1_TEMP_AIN2: CON_STAMP1.P$5 R79.2 STAMP1_ADC_TEMP.18(AIN3/IEXC/GPIO3)
STAMP1_TEMP_AIN3: CON_STAMP1.P$6 R80.2 R82.2
Unconnected: STAMP1_ADC_SG1.5(REFP0/GPIO0) STAMP1_ADC_SG1.6(REFN0/GPIO1) STAMP1_ADC_SG1.7(REFP1) STAMP1_ADC_SG1.8(REFN1) STAMP1_ADC_SG1.13(AIN4/IECG/GPIO4) STAMP1_ADC_SG1.14(AIN5/IEXC/GPIO5) STAMP1_ADC_SG1.15(AIN6/IEXC/GPIO6) STAMP1_ADC_SG1.16(AIN7/IEXC/GPIO7) STAMP1_ADC_SG1.17(AIN2/IEXC/GPIO2) STAMP1_ADC_SG1.18(AIN3/IEXC/GPIO3) STAMP1_ADC_SG1.19(IEXC2) STAMP1_ADC_SG1.20(IEXC1) STAMP1_ADC_SG2.5(REFP0/GPIO0) STAMP1_ADC_SG2.6(REFN0/GPIO1) STAMP1_ADC_SG2.7(REFP1) STAMP1_ADC_SG2.8(REFN1) STAMP1_ADC_SG2.13(AIN4/IECG/GPIO4) STAMP1_ADC_SG2.14(AIN5/IEXC/GPIO5) STAMP1_ADC_SG2.15(AIN6/IEXC/GPIO6) STAMP1_ADC_SG2.16(AIN7/IEXC/GPIO7) STAMP1_ADC_SG2.17(AIN2/IEXC/GPIO2) STAMP1_ADC_SG2.18(AIN3/IEXC/GPIO3) STAMP1_ADC_SG2.19(IEXC2) STAMP1_ADC_SG2.20(IEXC1) STAMP1_ADC_TEMP.7(REFP1) STAMP1_ADC_TEMP.8(REFN1) STAMP1_ADC_TEMP.13(AIN4/IECG/GPIO4) STAMP1_ADC_TEMP.14(AIN5/IEXC/GPIO5) STAMP1_ADC_TEMP.15(AIN6/IEXC/GPIO6) STAMP1_ADC_TEMP.16(AIN7/IEXC/GPIO7) STAMP1_ADC_TEMP.19(IEXC2) STAMP1_ADC_TEMP.20(IEXC1)

### Notes on the sheet
- STAMP 1
- 3dB attenuation @ 1989Hz | 3dB attenuation @ 1989Hz

## Sheet 4 of 8: STAMP 2
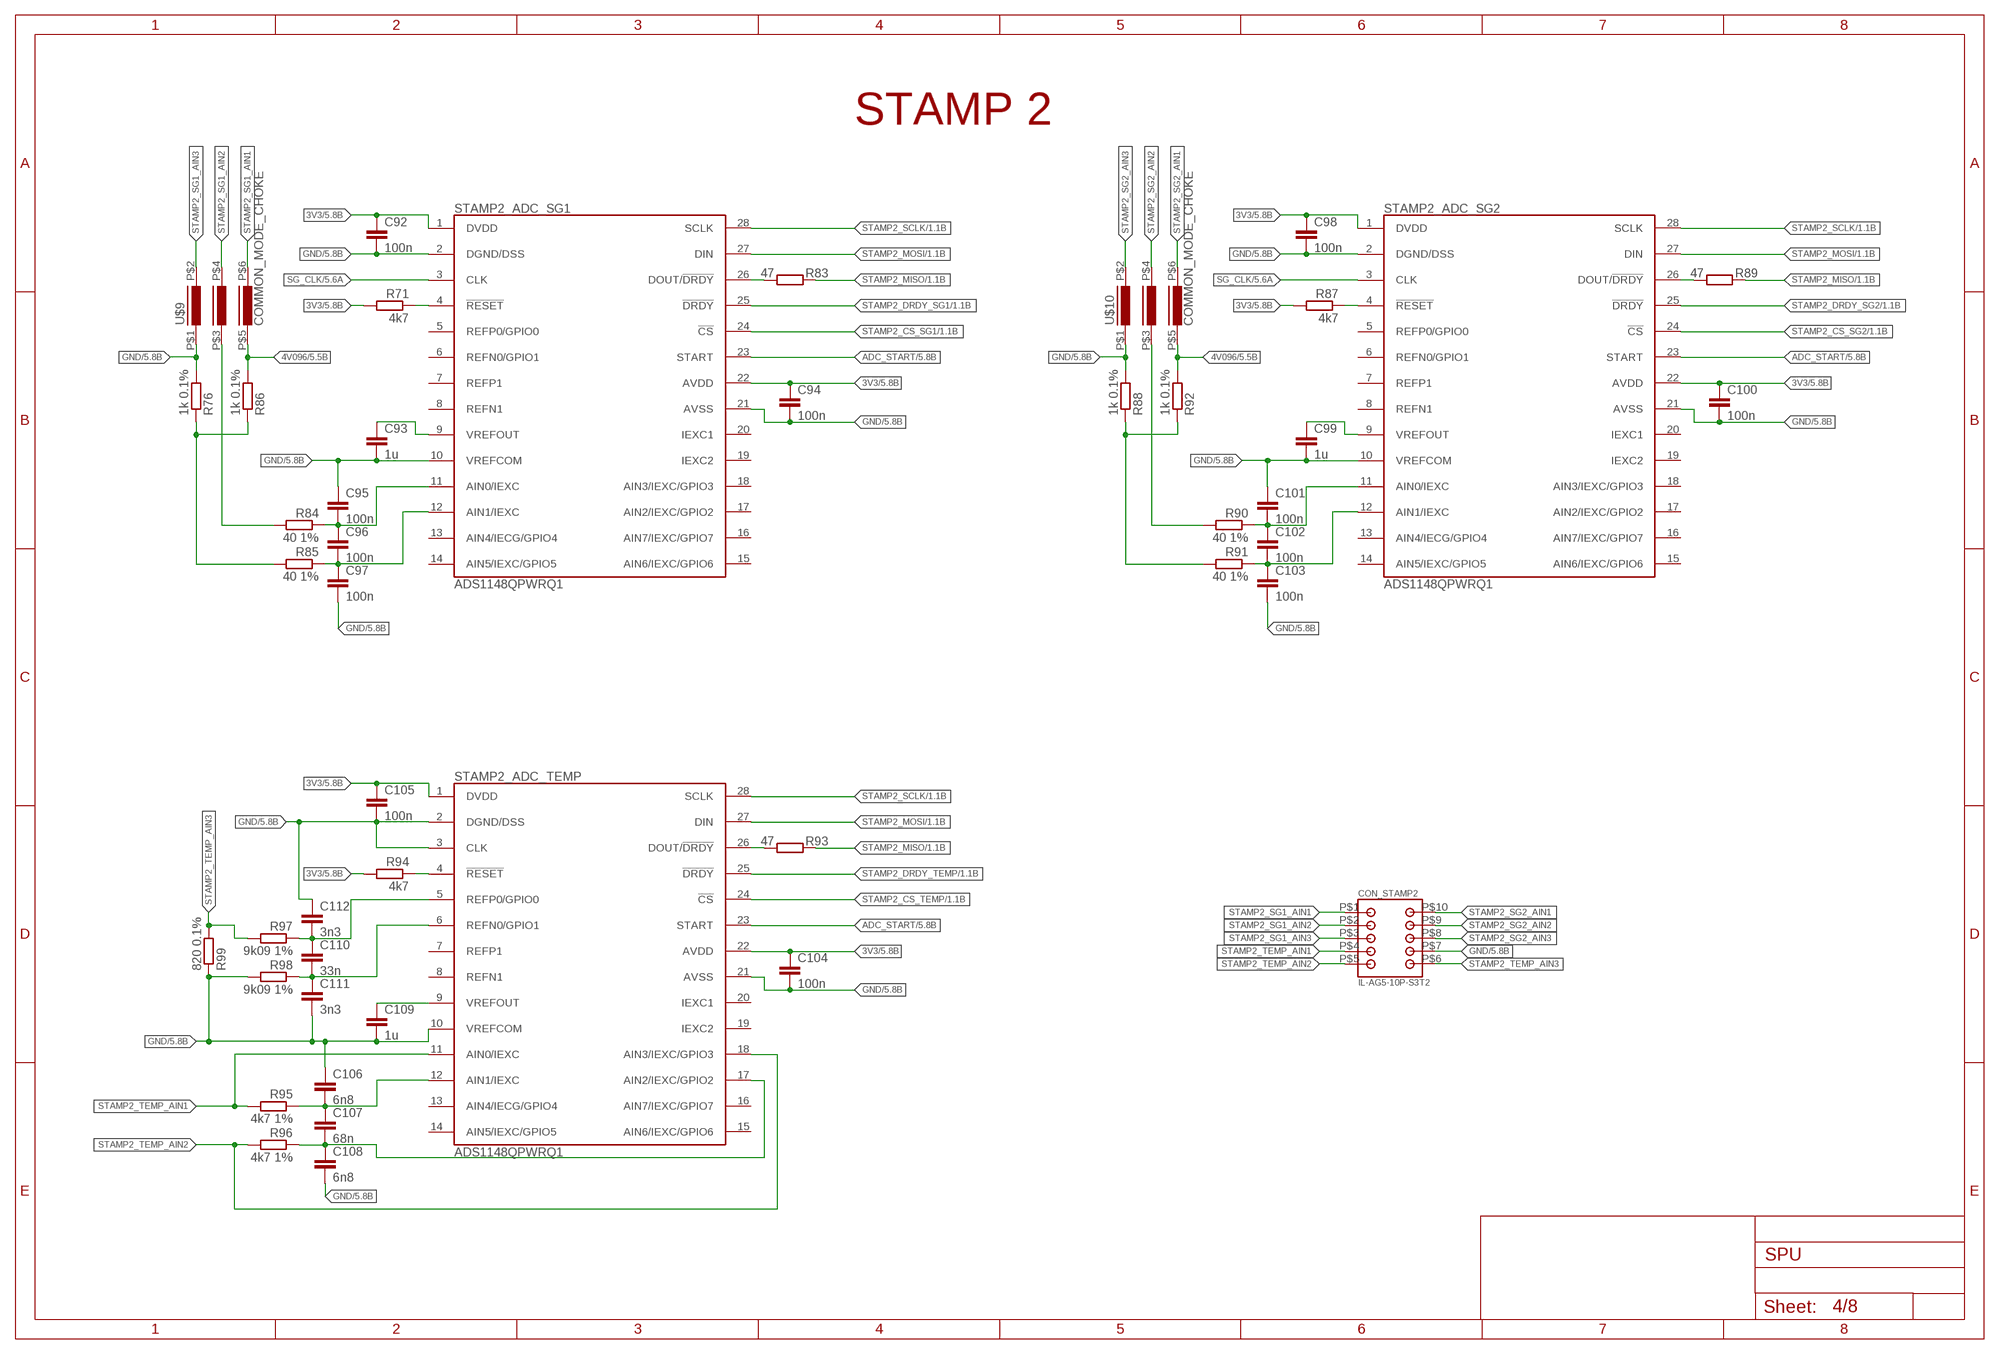
[diagram p3: schematic, sheet 4]

### Parts
C92  100n  C-EUC0805  [C0805]
C93  1u  C-EUC0805  [C0805]
C94  100n  C-EUC0805  [C0805]
C95  100n  C-EUC0805  [C0805]
C96  100n  C-EUC0805  [C0805]
C97  100n  C-EUC0805  [C0805]
C98  100n  C-EUC0805  [C0805]
C99  1u  C-EUC0805  [C0805]
C100  100n  C-EUC0805  [C0805]
C101  100n  C-EUC0805  [C0805]
C102  100n  C-EUC0805  [C0805]
C103  100n  C-EUC0805  [C0805]
C104  100n  C-EUC0805  [C0805]
C105  100n  C-EUC0805  [C0805]
C106  6n8  C-EUC0805  [C0805]
C107  68n  C-EUC0805  [C0805]
C108  6n8  C-EUC0805  [C0805]
C109  1u  C-EUC0805  [C0805]
C110  33n  C-EUC0805  [C0805]
C111  3n3  C-EUC0805  [C0805]
C112  3n3  C-EUC0805  [C0805]
CON_STAMP2  IL-AG5-10P-S3T2  [IL-AG5-10P-S3T2]
R71  4k7  R-EU_R0805  [R0805]
R76  1k 0.1%  R-EU_R0805  [R0805]
R83  47  R-EU_R0805  [R0805]
R84  40 1%  R-EU_R0805  [R0805]
R85  40 1%  R-EU_R0805  [R0805]
R86  1k 0.1%  R-EU_R0805  [R0805]
R87  4k7  R-EU_R0805  [R0805]
R88  1k 0.1%  R-EU_R0805  [R0805]
R89  47  R-EU_R0805  [R0805]
R90  40 1%  R-EU_R0805  [R0805]
R91  40 1%  R-EU_R0805  [R0805]
R92  1k 0.1%  R-EU_R0805  [R0805]
R93  47  R-EU_R0805  [R0805]
R94  4k7  R-EU_R0805  [R0805]
R95  4k7 1%  R-EU_R0805  [R0805]
R96  4k7 1%  R-EU_R0805  [R0805]
R97  9k09 1%  R-EU_R0805  [R0805]
R98  9k09 1%  R-EU_R0805  [R0805]
R99  820 0.1%  R-EU_R0805  [R0805]
STAMP2_ADC_SG1  ADS1148QPWRQ1  [TSSOP28]
STAMP2_ADC_SG2  ADS1148QPWRQ1  [TSSOP28]
STAMP2_ADC_TEMP  ADS1148QPWRQ1  [TSSOP28]
U$9  COMMON_MODE_CHOKE  [COMMON_MODE_CHOKE]
U$10  COMMON_MODE_CHOKE  [COMMON_MODE_CHOKE]

### Nets
3V3: C92.1 C94.1 C98.1 C100.1 C104.1 C105.1 R71.2 R87.2 R94.2 STAMP2_ADC_SG1.1(DVDD) STAMP2_ADC_SG1.22(AVDD) STAMP2_ADC_SG2.1(DVDD) STAMP2_ADC_SG2.22(AVDD) STAMP2_ADC_TEMP.1(DVDD) STAMP2_ADC_TEMP.22(AVDD) ; also sheet 1,2,3,5,6,7,8
4V096: R86.2 R92.2 U$9.P$5 U$10.P$5 ; also sheet 2,3,5,6,7,8
ADC_START: STAMP2_ADC_SG1.23(START) STAMP2_ADC_SG2.23(START) STAMP2_ADC_TEMP.23(START) ; also sheet 1,3,5,6,7,8
GND: C92.2 C93.2 C94.2 C95.1 C97.2 C98.2 C99.2 C100.2 C101.1 C103.2 C104.2 C105.2 C106.1 C108.2 C109.2 C111.2 C112.1 CON_STAMP2.P$7 R76.2 R88.2 R98.2 R99.1 STAMP2_ADC_SG1.2(DGND/DSS) STAMP2_ADC_SG1.10(VREFCOM) STAMP2_ADC_SG1.21(AVSS) STAMP2_ADC_SG2.2(DGND/DSS) STAMP2_ADC_SG2.10(VREFCOM) STAMP2_ADC_SG2.21(AVSS) STAMP2_ADC_TEMP.2(DGND/DSS) STAMP2_ADC_TEMP.3(CLK) STAMP2_ADC_TEMP.10(VREFCOM) STAMP2_ADC_TEMP.21(AVSS) U$9.P$1 U$10.P$1 ; also sheet 1,2,3,5,6,7,8
N$78: R71.1 STAMP2_ADC_SG1.4(!RESET)
N$85: C93.1 STAMP2_ADC_SG1.9(VREFOUT)
N$93: R83.2 STAMP2_ADC_SG1.26(DOUT/!DRDY)
N$94: C95.2 C96.1 R84.1 STAMP2_ADC_SG1.11(AIN0/IEXC)
N$95: C96.2 C97.1 R85.1 STAMP2_ADC_SG1.12(AIN1/IEXC)
N$96: R76.1 R85.2 R86.1
N$97: R84.2 U$9.P$3
N$98: R87.1 STAMP2_ADC_SG2.4(!RESET)
N$99: C99.1 STAMP2_ADC_SG2.9(VREFOUT)
N$100: R89.2 STAMP2_ADC_SG2.26(DOUT/!DRDY)
N$101: C101.2 C102.1 R90.1 STAMP2_ADC_SG2.11(AIN0/IEXC)
N$102: C102.2 C103.1 R91.1 STAMP2_ADC_SG2.12(AIN1/IEXC)
N$103: R88.1 R91.2 R92.1
N$104: R90.2 U$10.P$3
N$105: R93.2 STAMP2_ADC_TEMP.26(DOUT/!DRDY)
N$106: R94.1 STAMP2_ADC_TEMP.4(!RESET)
N$107: C106.2 C107.1 R95.1 STAMP2_ADC_TEMP.12(AIN1/IEXC)
N$108: C107.2 C108.1 R96.1 STAMP2_ADC_TEMP.17(AIN2/IEXC/GPIO2)
N$109: C109.1 STAMP2_ADC_TEMP.9(VREFOUT)
S2AT1: C110.1 C112.2 R97.1 STAMP2_ADC_TEMP.5(REFP0/GPIO0)
S2AT2: C110.2 C111.1 R98.1 STAMP2_ADC_TEMP.6(REFN0/GPIO1)
SG_CLK: STAMP2_ADC_SG1.3(CLK) STAMP2_ADC_SG2.3(CLK) ; also sheet 2,3,5,6,7,8
STAMP2_CS_SG1: STAMP2_ADC_SG1.24(!CS) ; also sheet 1
STAMP2_CS_SG2: STAMP2_ADC_SG2.24(!CS) ; also sheet 1
STAMP2_CS_TEMP: STAMP2_ADC_TEMP.24(!CS) ; also sheet 1
STAMP2_DRDY_SG1: STAMP2_ADC_SG1.25(!DRDY) ; also sheet 1
STAMP2_DRDY_SG2: STAMP2_ADC_SG2.25(!DRDY) ; also sheet 1
STAMP2_DRDY_TEMP: STAMP2_ADC_TEMP.25(!DRDY) ; also sheet 1
STAMP2_MISO: R83.1 R89.1 R93.1 ; also sheet 1
STAMP2_MOSI: STAMP2_ADC_SG1.27(DIN) STAMP2_ADC_SG2.27(DIN) STAMP2_ADC_TEMP.27(DIN) ; also sheet 1
STAMP2_SCLK: STAMP2_ADC_SG1.28(SCLK) STAMP2_ADC_SG2.28(SCLK) STAMP2_ADC_TEMP.28(SCLK) ; also sheet 1
STAMP2_SG1_AIN1: CON_STAMP2.P$1 U$9.P$6
STAMP2_SG1_AIN2: CON_STAMP2.P$2 U$9.P$4
STAMP2_SG1_AIN3: CON_STAMP2.P$3 U$9.P$2
STAMP2_SG2_AIN1: CON_STAMP2.P$10 U$10.P$6
STAMP2_SG2_AIN2: CON_STAMP2.P$9 U$10.P$4
STAMP2_SG2_AIN3: CON_STAMP2.P$8 U$10.P$2
STAMP2_TEMP_AIN1: CON_STAMP2.P$4 R95.2 STAMP2_ADC_TEMP.11(AIN0/IEXC)
STAMP2_TEMP_AIN2: CON_STAMP2.P$5 R96.2 STAMP2_ADC_TEMP.18(AIN3/IEXC/GPIO3)
STAMP2_TEMP_AIN3: CON_STAMP2.P$6 R97.2 R99.2
Unconnected: STAMP2_ADC_SG1.5(REFP0/GPIO0) STAMP2_ADC_SG1.6(REFN0/GPIO1) STAMP2_ADC_SG1.7(REFP1) STAMP2_ADC_SG1.8(REFN1) STAMP2_ADC_SG1.13(AIN4/IECG/GPIO4) STAMP2_ADC_SG1.14(AIN5/IEXC/GPIO5) STAMP2_ADC_SG1.15(AIN6/IEXC/GPIO6) STAMP2_ADC_SG1.16(AIN7/IEXC/GPIO7) STAMP2_ADC_SG1.17(AIN2/IEXC/GPIO2) STAMP2_ADC_SG1.18(AIN3/IEXC/GPIO3) STAMP2_ADC_SG1.19(IEXC2) STAMP2_ADC_SG1.20(IEXC1) STAMP2_ADC_SG2.5(REFP0/GPIO0) STAMP2_ADC_SG2.6(REFN0/GPIO1) STAMP2_ADC_SG2.7(REFP1) STAMP2_ADC_SG2.8(REFN1) STAMP2_ADC_SG2.13(AIN4/IECG/GPIO4) STAMP2_ADC_SG2.14(AIN5/IEXC/GPIO5) STAMP2_ADC_SG2.15(AIN6/IEXC/GPIO6) STAMP2_ADC_SG2.16(AIN7/IEXC/GPIO7) STAMP2_ADC_SG2.17(AIN2/IEXC/GPIO2) STAMP2_ADC_SG2.18(AIN3/IEXC/GPIO3) STAMP2_ADC_SG2.19(IEXC2) STAMP2_ADC_SG2.20(IEXC1) STAMP2_ADC_TEMP.7(REFP1) STAMP2_ADC_TEMP.8(REFN1) STAMP2_ADC_TEMP.13(AIN4/IECG/GPIO4) STAMP2_ADC_TEMP.14(AIN5/IEXC/GPIO5) STAMP2_ADC_TEMP.15(AIN6/IEXC/GPIO6) STAMP2_ADC_TEMP.16(AIN7/IEXC/GPIO7) STAMP2_ADC_TEMP.19(IEXC2) STAMP2_ADC_TEMP.20(IEXC1)

### Notes on the sheet
- STAMP 2

## Sheet 5 of 8: STAMP 3
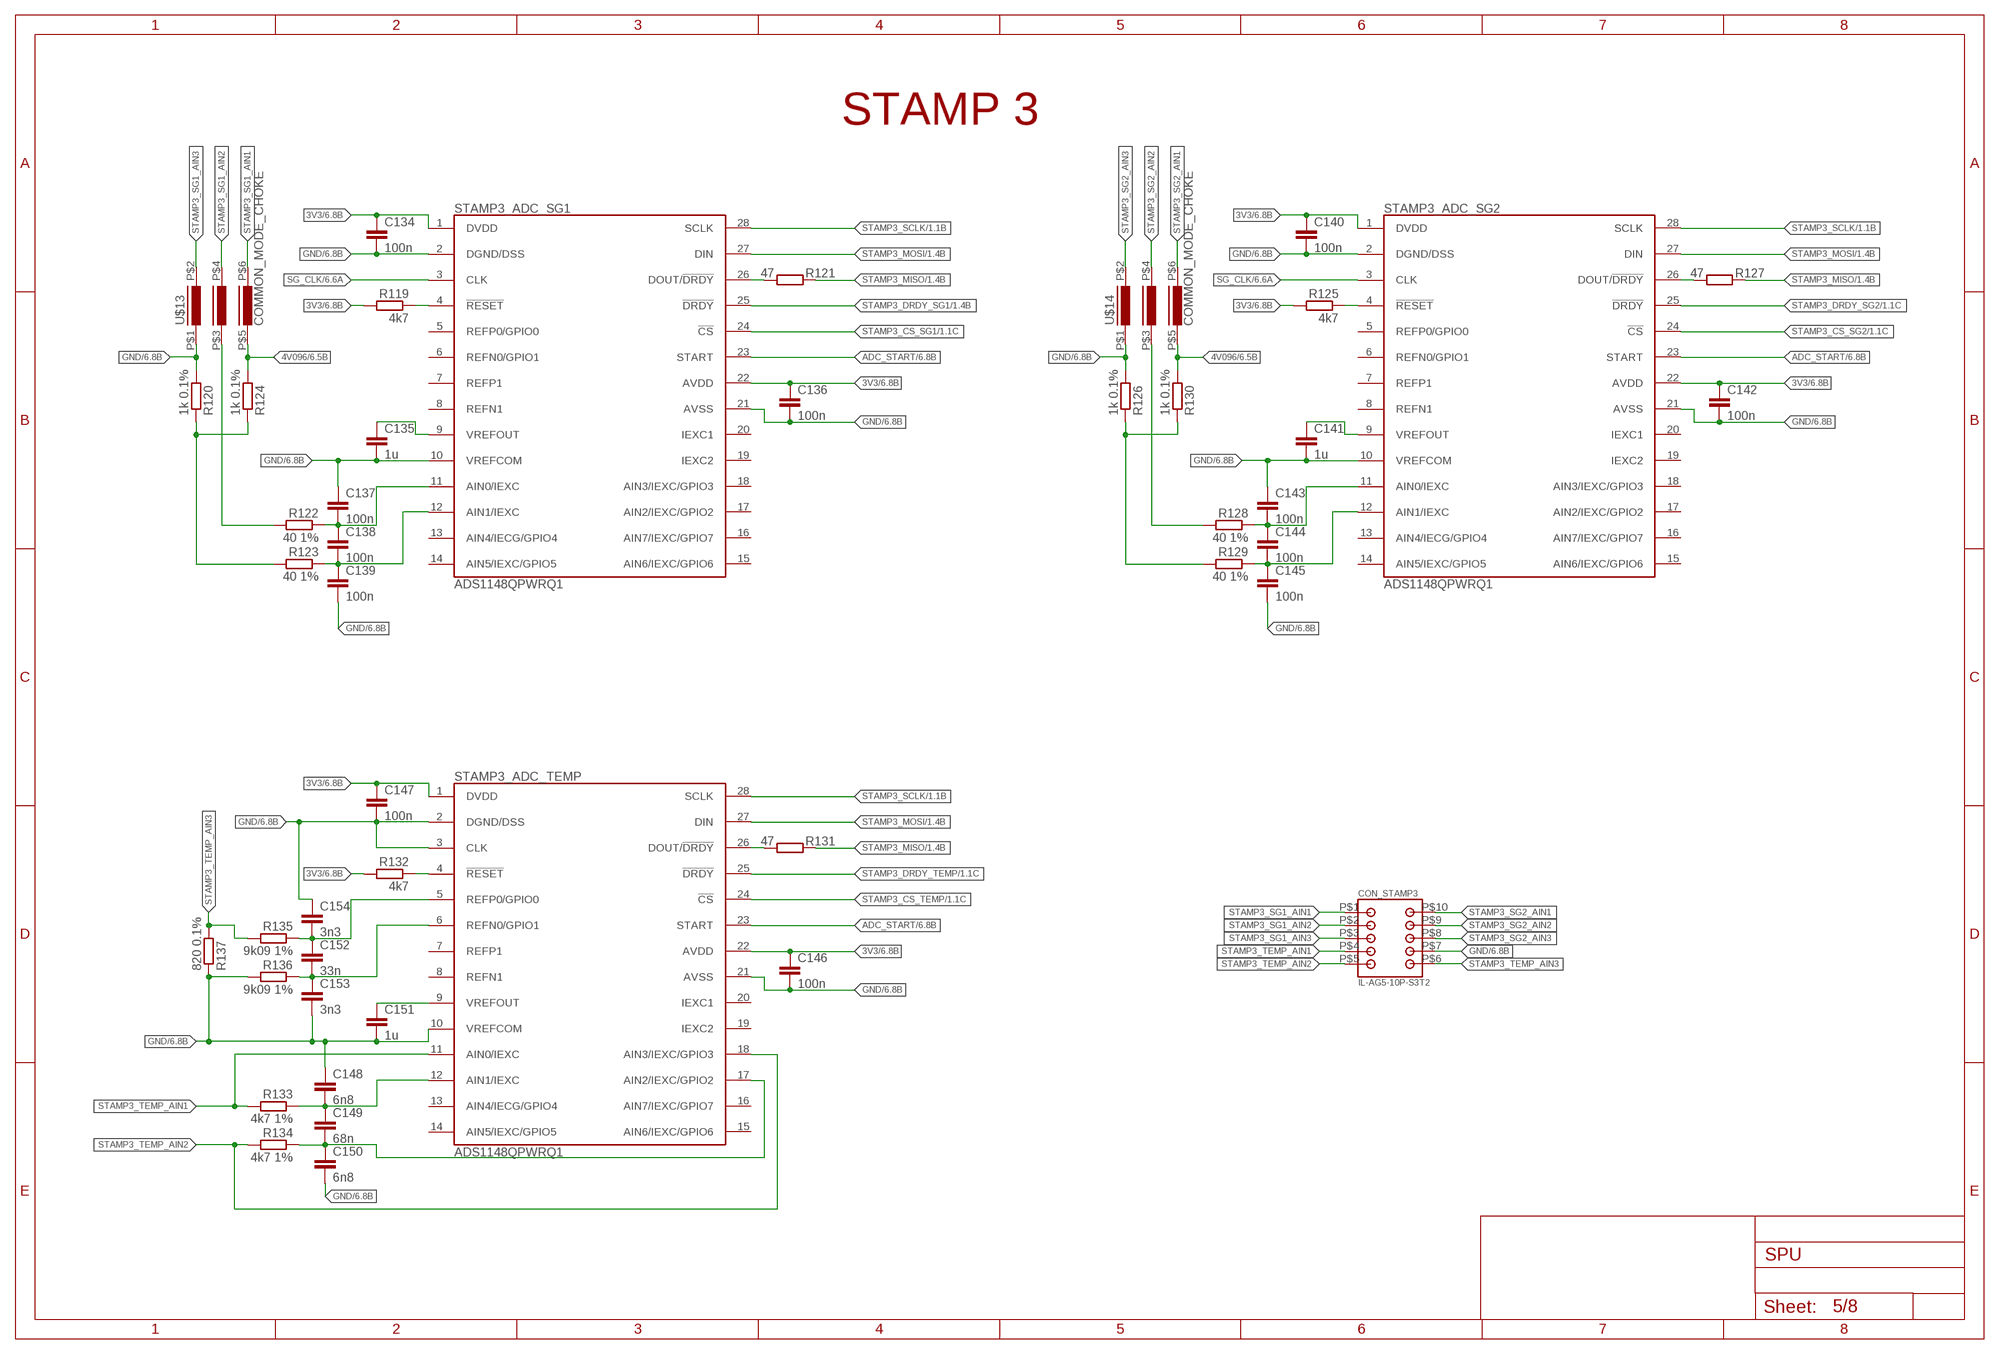
[diagram p4: schematic, sheet 5]

### Parts
C134  100n  C-EUC0805  [C0805]
C135  1u  C-EUC0805  [C0805]
C136  100n  C-EUC0805  [C0805]
C137  100n  C-EUC0805  [C0805]
C138  100n  C-EUC0805  [C0805]
C139  100n  C-EUC0805  [C0805]
C140  100n  C-EUC0805  [C0805]
C141  1u  C-EUC0805  [C0805]
C142  100n  C-EUC0805  [C0805]
C143  100n  C-EUC0805  [C0805]
C144  100n  C-EUC0805  [C0805]
C145  100n  C-EUC0805  [C0805]
C146  100n  C-EUC0805  [C0805]
C147  100n  C-EUC0805  [C0805]
C148  6n8  C-EUC0805  [C0805]
C149  68n  C-EUC0805  [C0805]
C150  6n8  C-EUC0805  [C0805]
C151  1u  C-EUC0805  [C0805]
C152  33n  C-EUC0805  [C0805]
C153  3n3  C-EUC0805  [C0805]
C154  3n3  C-EUC0805  [C0805]
CON_STAMP3  IL-AG5-10P-S3T2  [IL-AG5-10P-S3T2]
R119  4k7  R-EU_R0805  [R0805]
R120  1k 0.1%  R-EU_R0805  [R0805]
R121  47  R-EU_R0805  [R0805]
R122  40 1%  R-EU_R0805  [R0805]
R123  40 1%  R-EU_R0805  [R0805]
R124  1k 0.1%  R-EU_R0805  [R0805]
R125  4k7  R-EU_R0805  [R0805]
R126  1k 0.1%  R-EU_R0805  [R0805]
R127  47  R-EU_R0805  [R0805]
R128  40 1%  R-EU_R0805  [R0805]
R129  40 1%  R-EU_R0805  [R0805]
R130  1k 0.1%  R-EU_R0805  [R0805]
R131  47  R-EU_R0805  [R0805]
R132  4k7  R-EU_R0805  [R0805]
R133  4k7 1%  R-EU_R0805  [R0805]
R134  4k7 1%  R-EU_R0805  [R0805]
R135  9k09 1%  R-EU_R0805  [R0805]
R136  9k09 1%  R-EU_R0805  [R0805]
R137  820 0.1%  R-EU_R0805  [R0805]
STAMP3_ADC_SG1  ADS1148QPWRQ1  [TSSOP28]
STAMP3_ADC_SG2  ADS1148QPWRQ1  [TSSOP28]
STAMP3_ADC_TEMP  ADS1148QPWRQ1  [TSSOP28]
U$13  COMMON_MODE_CHOKE  [COMMON_MODE_CHOKE]
U$14  COMMON_MODE_CHOKE  [COMMON_MODE_CHOKE]

### Nets
3V3: C134.1 C136.1 C140.1 C142.1 C146.1 C147.1 R119.2 R125.2 R132.2 STAMP3_ADC_SG1.1(DVDD) STAMP3_ADC_SG1.22(AVDD) STAMP3_ADC_SG2.1(DVDD) STAMP3_ADC_SG2.22(AVDD) STAMP3_ADC_TEMP.1(DVDD) STAMP3_ADC_TEMP.22(AVDD) ; also sheet 1,2,3,4,6,7,8
4V096: R124.2 R130.2 U$13.P$5 U$14.P$5 ; also sheet 2,3,4,6,7,8
ADC_START: STAMP3_ADC_SG1.23(START) STAMP3_ADC_SG2.23(START) STAMP3_ADC_TEMP.23(START) ; also sheet 1,3,4,6,7,8
GND: C134.2 C135.2 C136.2 C137.1 C139.2 C140.2 C141.2 C142.2 C143.1 C145.2 C146.2 C147.2 C148.1 C150.2 C151.2 C153.2 C154.1 CON_STAMP3.P$7 R120.2 R126.2 R136.2 R137.1 STAMP3_ADC_SG1.2(DGND/DSS) STAMP3_ADC_SG1.10(VREFCOM) STAMP3_ADC_SG1.21(AVSS) STAMP3_ADC_SG2.2(DGND/DSS) STAMP3_ADC_SG2.10(VREFCOM) STAMP3_ADC_SG2.21(AVSS) STAMP3_ADC_TEMP.2(DGND/DSS) STAMP3_ADC_TEMP.3(CLK) STAMP3_ADC_TEMP.10(VREFCOM) STAMP3_ADC_TEMP.21(AVSS) U$13.P$1 U$14.P$1 ; also sheet 1,2,3,4,6,7,8
N$133: R119.1 STAMP3_ADC_SG1.4(!RESET)
N$134: C135.1 STAMP3_ADC_SG1.9(VREFOUT)
N$135: R121.2 STAMP3_ADC_SG1.26(DOUT/!DRDY)
N$136: C137.2 C138.1 R122.1 STAMP3_ADC_SG1.11(AIN0/IEXC)
N$137: C138.2 C139.1 R123.1 STAMP3_ADC_SG1.12(AIN1/IEXC)
N$138: R120.1 R123.2 R124.1
N$139: R122.2 U$13.P$3
N$140: R125.1 STAMP3_ADC_SG2.4(!RESET)
N$141: C141.1 STAMP3_ADC_SG2.9(VREFOUT)
N$142: R127.2 STAMP3_ADC_SG2.26(DOUT/!DRDY)
N$143: C143.2 C144.1 R128.1 STAMP3_ADC_SG2.11(AIN0/IEXC)
N$144: C144.2 C145.1 R129.1 STAMP3_ADC_SG2.12(AIN1/IEXC)
N$145: R126.1 R129.2 R130.1
N$146: R128.2 U$14.P$3
N$147: R131.2 STAMP3_ADC_TEMP.26(DOUT/!DRDY)
N$148: R132.1 STAMP3_ADC_TEMP.4(!RESET)
N$149: C148.2 C149.1 R133.1 STAMP3_ADC_TEMP.12(AIN1/IEXC)
N$150: C149.2 C150.1 R134.1 STAMP3_ADC_TEMP.17(AIN2/IEXC/GPIO2)
N$151: C151.1 STAMP3_ADC_TEMP.9(VREFOUT)
N$152: C152.2 C153.1 R136.1 STAMP3_ADC_TEMP.6(REFN0/GPIO1)
N$153: C152.1 C154.2 R135.1 STAMP3_ADC_TEMP.5(REFP0/GPIO0)
SG_CLK: STAMP3_ADC_SG1.3(CLK) STAMP3_ADC_SG2.3(CLK) ; also sheet 2,3,4,6,7,8
STAMP3_CS_SG1: STAMP3_ADC_SG1.24(!CS) ; also sheet 1
STAMP3_CS_SG2: STAMP3_ADC_SG2.24(!CS) ; also sheet 1
STAMP3_CS_TEMP: STAMP3_ADC_TEMP.24(!CS) ; also sheet 1
STAMP3_DRDY_SG1: STAMP3_ADC_SG1.25(!DRDY) ; also sheet 1
STAMP3_DRDY_SG2: STAMP3_ADC_SG2.25(!DRDY) ; also sheet 1
STAMP3_DRDY_TEMP: STAMP3_ADC_TEMP.25(!DRDY) ; also sheet 1
STAMP3_MISO: R121.1 R127.1 R131.1 ; also sheet 1
STAMP3_MOSI: STAMP3_ADC_SG1.27(DIN) STAMP3_ADC_SG2.27(DIN) STAMP3_ADC_TEMP.27(DIN) ; also sheet 1
STAMP3_SCLK: STAMP3_ADC_SG1.28(SCLK) STAMP3_ADC_SG2.28(SCLK) STAMP3_ADC_TEMP.28(SCLK) ; also sheet 1
STAMP3_SG1_AIN1: CON_STAMP3.P$1 U$13.P$6
STAMP3_SG1_AIN2: CON_STAMP3.P$2 U$13.P$4
STAMP3_SG1_AIN3: CON_STAMP3.P$3 U$13.P$2
STAMP3_SG2_AIN1: CON_STAMP3.P$10 U$14.P$6
STAMP3_SG2_AIN2: CON_STAMP3.P$9 U$14.P$4
STAMP3_SG2_AIN3: CON_STAMP3.P$8 U$14.P$2
STAMP3_TEMP_AIN1: CON_STAMP3.P$4 R133.2 STAMP3_ADC_TEMP.11(AIN0/IEXC)
STAMP3_TEMP_AIN2: CON_STAMP3.P$5 R134.2 STAMP3_ADC_TEMP.18(AIN3/IEXC/GPIO3)
STAMP3_TEMP_AIN3: CON_STAMP3.P$6 R135.2 R137.2
Unconnected: STAMP3_ADC_SG1.5(REFP0/GPIO0) STAMP3_ADC_SG1.6(REFN0/GPIO1) STAMP3_ADC_SG1.7(REFP1) STAMP3_ADC_SG1.8(REFN1) STAMP3_ADC_SG1.13(AIN4/IECG/GPIO4) STAMP3_ADC_SG1.14(AIN5/IEXC/GPIO5) STAMP3_ADC_SG1.15(AIN6/IEXC/GPIO6) STAMP3_ADC_SG1.16(AIN7/IEXC/GPIO7) STAMP3_ADC_SG1.17(AIN2/IEXC/GPIO2) STAMP3_ADC_SG1.18(AIN3/IEXC/GPIO3) STAMP3_ADC_SG1.19(IEXC2) STAMP3_ADC_SG1.20(IEXC1) STAMP3_ADC_SG2.5(REFP0/GPIO0) STAMP3_ADC_SG2.6(REFN0/GPIO1) STAMP3_ADC_SG2.7(REFP1) STAMP3_ADC_SG2.8(REFN1) STAMP3_ADC_SG2.13(AIN4/IECG/GPIO4) STAMP3_ADC_SG2.14(AIN5/IEXC/GPIO5) STAMP3_ADC_SG2.15(AIN6/IEXC/GPIO6) STAMP3_ADC_SG2.16(AIN7/IEXC/GPIO7) STAMP3_ADC_SG2.17(AIN2/IEXC/GPIO2) STAMP3_ADC_SG2.18(AIN3/IEXC/GPIO3) STAMP3_ADC_SG2.19(IEXC2) STAMP3_ADC_SG2.20(IEXC1) STAMP3_ADC_TEMP.7(REFP1) STAMP3_ADC_TEMP.8(REFN1) STAMP3_ADC_TEMP.13(AIN4/IECG/GPIO4) STAMP3_ADC_TEMP.14(AIN5/IEXC/GPIO5) STAMP3_ADC_TEMP.15(AIN6/IEXC/GPIO6) STAMP3_ADC_TEMP.16(AIN7/IEXC/GPIO7) STAMP3_ADC_TEMP.19(IEXC2) STAMP3_ADC_TEMP.20(IEXC1)

### Notes on the sheet
- STAMP 3

## Sheet 6 of 8: STAMP 4
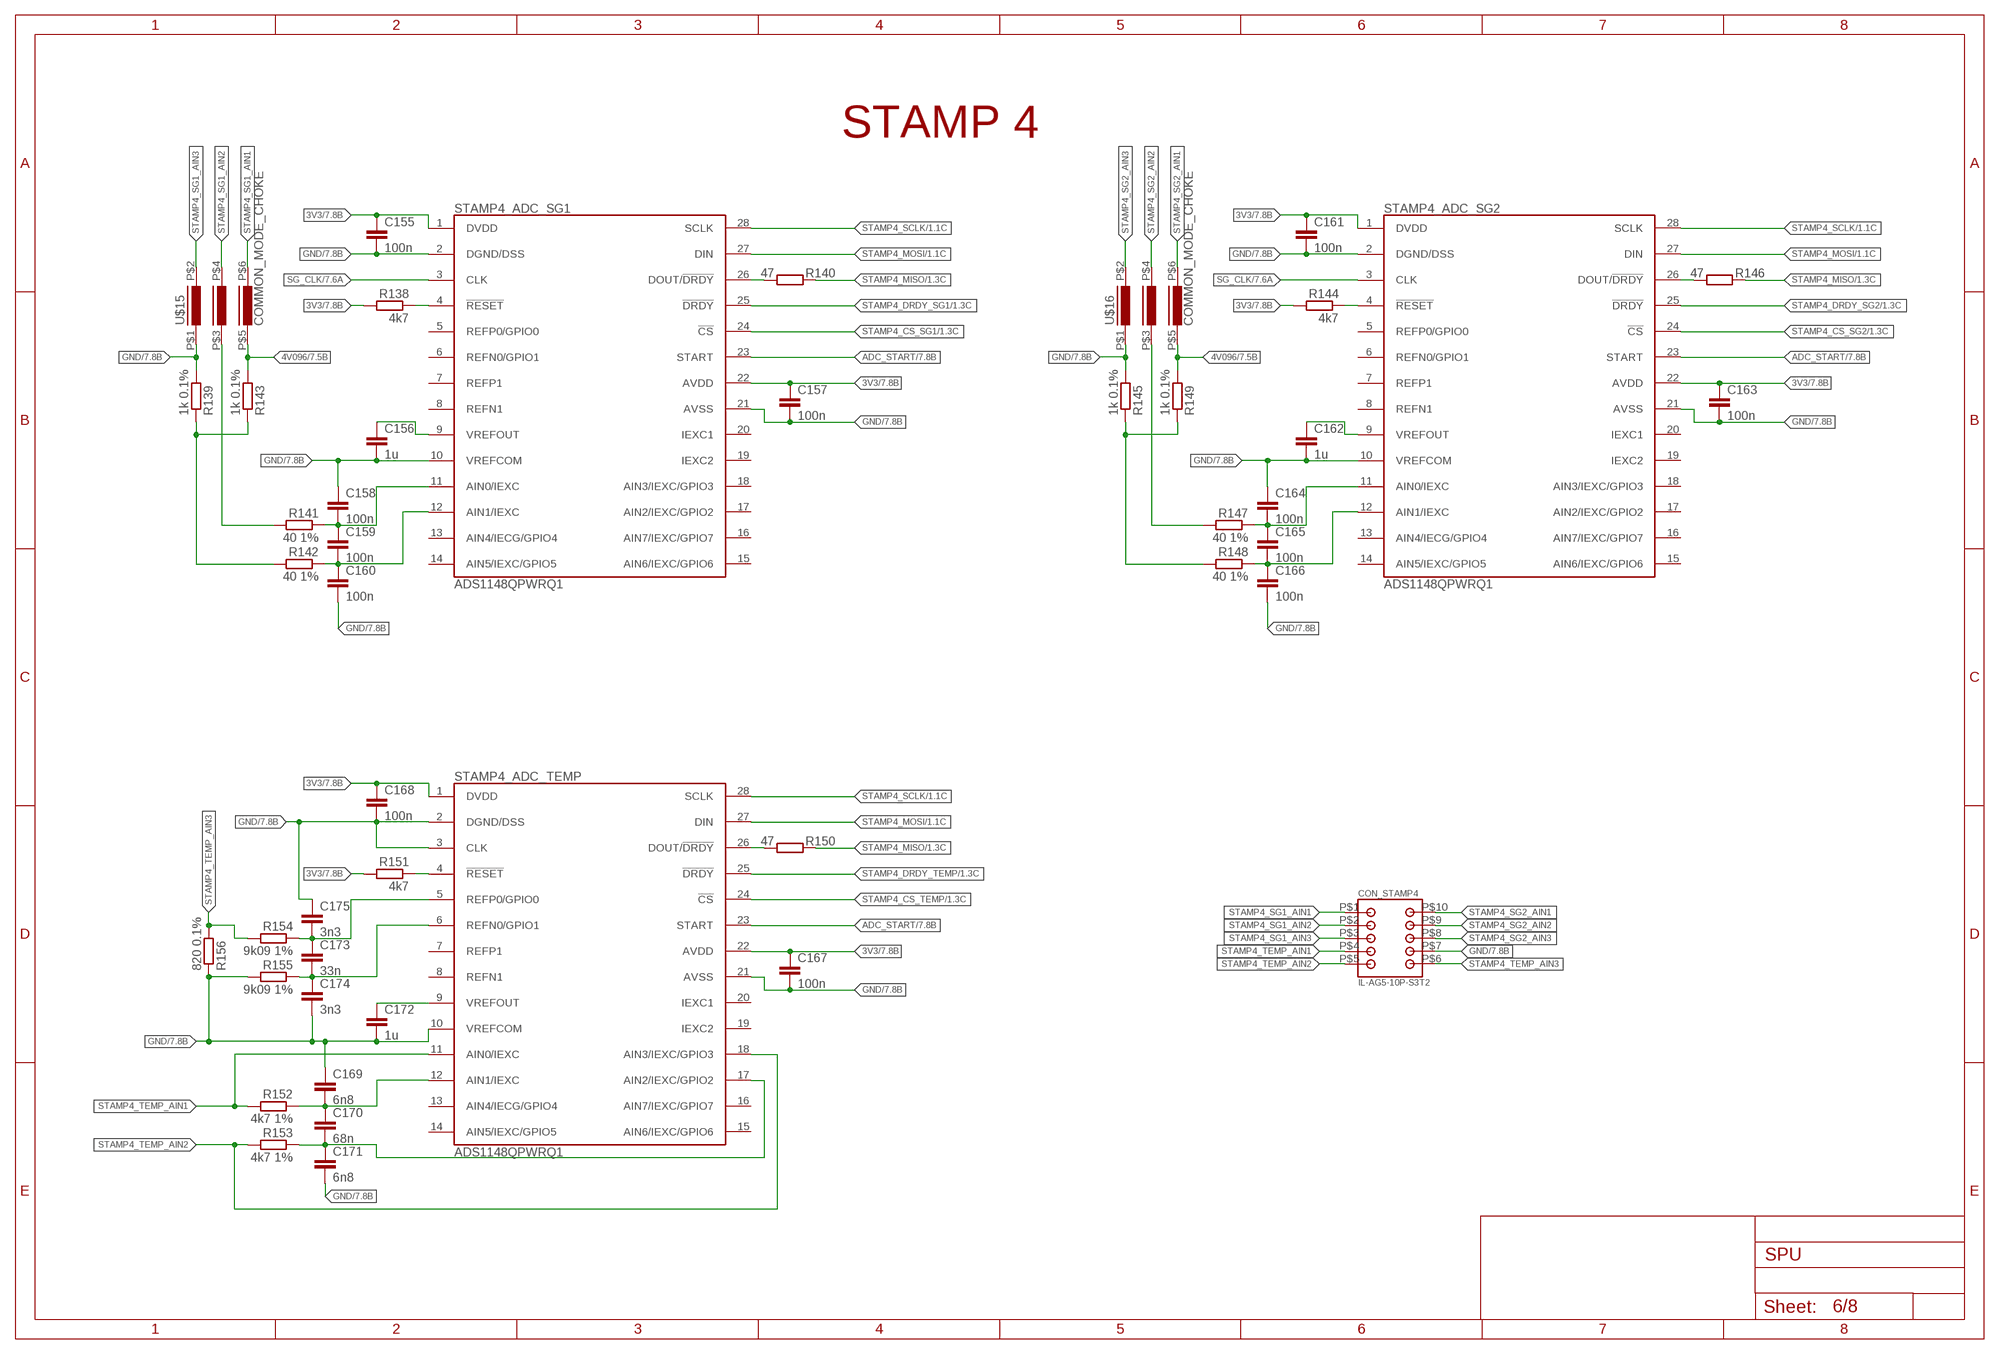
[diagram p5: schematic, sheet 6]

### Parts
C155  100n  C-EUC0805  [C0805]
C156  1u  C-EUC0805  [C0805]
C157  100n  C-EUC0805  [C0805]
C158  100n  C-EUC0805  [C0805]
C159  100n  C-EUC0805  [C0805]
C160  100n  C-EUC0805  [C0805]
C161  100n  C-EUC0805  [C0805]
C162  1u  C-EUC0805  [C0805]
C163  100n  C-EUC0805  [C0805]
C164  100n  C-EUC0805  [C0805]
C165  100n  C-EUC0805  [C0805]
C166  100n  C-EUC0805  [C0805]
C167  100n  C-EUC0805  [C0805]
C168  100n  C-EUC0805  [C0805]
C169  6n8  C-EUC0805  [C0805]
C170  68n  C-EUC0805  [C0805]
C171  6n8  C-EUC0805  [C0805]
C172  1u  C-EUC0805  [C0805]
C173  33n  C-EUC0805  [C0805]
C174  3n3  C-EUC0805  [C0805]
C175  3n3  C-EUC0805  [C0805]
CON_STAMP4  IL-AG5-10P-S3T2  [IL-AG5-10P-S3T2]
R138  4k7  R-EU_R0805  [R0805]
R139  1k 0.1%  R-EU_R0805  [R0805]
R140  47  R-EU_R0805  [R0805]
R141  40 1%  R-EU_R0805  [R0805]
R142  40 1%  R-EU_R0805  [R0805]
R143  1k 0.1%  R-EU_R0805  [R0805]
R144  4k7  R-EU_R0805  [R0805]
R145  1k 0.1%  R-EU_R0805  [R0805]
R146  47  R-EU_R0805  [R0805]
R147  40 1%  R-EU_R0805  [R0805]
R148  40 1%  R-EU_R0805  [R0805]
R149  1k 0.1%  R-EU_R0805  [R0805]
R150  47  R-EU_R0805  [R0805]
R151  4k7  R-EU_R0805  [R0805]
R152  4k7 1%  R-EU_R0805  [R0805]
R153  4k7 1%  R-EU_R0805  [R0805]
R154  9k09 1%  R-EU_R0805  [R0805]
R155  9k09 1%  R-EU_R0805  [R0805]
R156  820 0.1%  R-EU_R0805  [R0805]
STAMP4_ADC_SG1  ADS1148QPWRQ1  [TSSOP28]
STAMP4_ADC_SG2  ADS1148QPWRQ1  [TSSOP28]
STAMP4_ADC_TEMP  ADS1148QPWRQ1  [TSSOP28]
U$15  COMMON_MODE_CHOKE  [COMMON_MODE_CHOKE]
U$16  COMMON_MODE_CHOKE  [COMMON_MODE_CHOKE]

### Nets
3V3: C155.1 C157.1 C161.1 C163.1 C167.1 C168.1 R138.2 R144.2 R151.2 STAMP4_ADC_SG1.1(DVDD) STAMP4_ADC_SG1.22(AVDD) STAMP4_ADC_SG2.1(DVDD) STAMP4_ADC_SG2.22(AVDD) STAMP4_ADC_TEMP.1(DVDD) STAMP4_ADC_TEMP.22(AVDD) ; also sheet 1,2,3,4,5,7,8
4V096: R143.2 R149.2 U$15.P$5 U$16.P$5 ; also sheet 2,3,4,5,7,8
ADC_START: STAMP4_ADC_SG1.23(START) STAMP4_ADC_SG2.23(START) STAMP4_ADC_TEMP.23(START) ; also sheet 1,3,4,5,7,8
GND: C155.2 C156.2 C157.2 C158.1 C160.2 C161.2 C162.2 C163.2 C164.1 C166.2 C167.2 C168.2 C169.1 C171.2 C172.2 C174.2 C175.1 CON_STAMP4.P$7 R139.2 R145.2 R155.2 R156.1 STAMP4_ADC_SG1.2(DGND/DSS) STAMP4_ADC_SG1.10(VREFCOM) STAMP4_ADC_SG1.21(AVSS) STAMP4_ADC_SG2.2(DGND/DSS) STAMP4_ADC_SG2.10(VREFCOM) STAMP4_ADC_SG2.21(AVSS) STAMP4_ADC_TEMP.2(DGND/DSS) STAMP4_ADC_TEMP.3(CLK) STAMP4_ADC_TEMP.10(VREFCOM) STAMP4_ADC_TEMP.21(AVSS) U$15.P$1 U$16.P$1 ; also sheet 1,2,3,4,5,7,8
N$154: R138.1 STAMP4_ADC_SG1.4(!RESET)
N$155: C156.1 STAMP4_ADC_SG1.9(VREFOUT)
N$156: R140.2 STAMP4_ADC_SG1.26(DOUT/!DRDY)
N$157: C158.2 C159.1 R141.1 STAMP4_ADC_SG1.11(AIN0/IEXC)
N$158: C159.2 C160.1 R142.1 STAMP4_ADC_SG1.12(AIN1/IEXC)
N$159: R139.1 R142.2 R143.1
N$160: R141.2 U$15.P$3
N$161: R144.1 STAMP4_ADC_SG2.4(!RESET)
N$162: C162.1 STAMP4_ADC_SG2.9(VREFOUT)
N$163: R146.2 STAMP4_ADC_SG2.26(DOUT/!DRDY)
N$164: C164.2 C165.1 R147.1 STAMP4_ADC_SG2.11(AIN0/IEXC)
N$165: C165.2 C166.1 R148.1 STAMP4_ADC_SG2.12(AIN1/IEXC)
N$166: R145.1 R148.2 R149.1
N$167: R147.2 U$16.P$3
N$168: R150.2 STAMP4_ADC_TEMP.26(DOUT/!DRDY)
N$169: R151.1 STAMP4_ADC_TEMP.4(!RESET)
N$170: C169.2 C170.1 R152.1 STAMP4_ADC_TEMP.12(AIN1/IEXC)
N$171: C170.2 C171.1 R153.1 STAMP4_ADC_TEMP.17(AIN2/IEXC/GPIO2)
N$172: C172.1 STAMP4_ADC_TEMP.9(VREFOUT)
N$173: C173.2 C174.1 R155.1 STAMP4_ADC_TEMP.6(REFN0/GPIO1)
N$174: C173.1 C175.2 R154.1 STAMP4_ADC_TEMP.5(REFP0/GPIO0)
SG_CLK: STAMP4_ADC_SG1.3(CLK) STAMP4_ADC_SG2.3(CLK) ; also sheet 2,3,4,5,7,8
STAMP4_CS_SG1: STAMP4_ADC_SG1.24(!CS) ; also sheet 1
STAMP4_CS_SG2: STAMP4_ADC_SG2.24(!CS) ; also sheet 1
STAMP4_CS_TEMP: STAMP4_ADC_TEMP.24(!CS) ; also sheet 1
STAMP4_DRDY_SG1: STAMP4_ADC_SG1.25(!DRDY) ; also sheet 1
STAMP4_DRDY_SG2: STAMP4_ADC_SG2.25(!DRDY) ; also sheet 1
STAMP4_DRDY_TEMP: STAMP4_ADC_TEMP.25(!DRDY) ; also sheet 1
STAMP4_MISO: R140.1 R146.1 R150.1 ; also sheet 1
STAMP4_MOSI: STAMP4_ADC_SG1.27(DIN) STAMP4_ADC_SG2.27(DIN) STAMP4_ADC_TEMP.27(DIN) ; also sheet 1
STAMP4_SCLK: STAMP4_ADC_SG1.28(SCLK) STAMP4_ADC_SG2.28(SCLK) STAMP4_ADC_TEMP.28(SCLK) ; also sheet 1
STAMP4_SG1_AIN1: CON_STAMP4.P$1 U$15.P$6
STAMP4_SG1_AIN2: CON_STAMP4.P$2 U$15.P$4
STAMP4_SG1_AIN3: CON_STAMP4.P$3 U$15.P$2
STAMP4_SG2_AIN1: CON_STAMP4.P$10 U$16.P$6
STAMP4_SG2_AIN2: CON_STAMP4.P$9 U$16.P$4
STAMP4_SG2_AIN3: CON_STAMP4.P$8 U$16.P$2
STAMP4_TEMP_AIN1: CON_STAMP4.P$4 R152.2 STAMP4_ADC_TEMP.11(AIN0/IEXC)
STAMP4_TEMP_AIN2: CON_STAMP4.P$5 R153.2 STAMP4_ADC_TEMP.18(AIN3/IEXC/GPIO3)
STAMP4_TEMP_AIN3: CON_STAMP4.P$6 R154.2 R156.2
Unconnected: STAMP4_ADC_SG1.5(REFP0/GPIO0) STAMP4_ADC_SG1.6(REFN0/GPIO1) STAMP4_ADC_SG1.7(REFP1) STAMP4_ADC_SG1.8(REFN1) STAMP4_ADC_SG1.13(AIN4/IECG/GPIO4) STAMP4_ADC_SG1.14(AIN5/IEXC/GPIO5) STAMP4_ADC_SG1.15(AIN6/IEXC/GPIO6) STAMP4_ADC_SG1.16(AIN7/IEXC/GPIO7) STAMP4_ADC_SG1.17(AIN2/IEXC/GPIO2) STAMP4_ADC_SG1.18(AIN3/IEXC/GPIO3) STAMP4_ADC_SG1.19(IEXC2) STAMP4_ADC_SG1.20(IEXC1) STAMP4_ADC_SG2.5(REFP0/GPIO0) STAMP4_ADC_SG2.6(REFN0/GPIO1) STAMP4_ADC_SG2.7(REFP1) STAMP4_ADC_SG2.8(REFN1) STAMP4_ADC_SG2.13(AIN4/IECG/GPIO4) STAMP4_ADC_SG2.14(AIN5/IEXC/GPIO5) STAMP4_ADC_SG2.15(AIN6/IEXC/GPIO6) STAMP4_ADC_SG2.16(AIN7/IEXC/GPIO7) STAMP4_ADC_SG2.17(AIN2/IEXC/GPIO2) STAMP4_ADC_SG2.18(AIN3/IEXC/GPIO3) STAMP4_ADC_SG2.19(IEXC2) STAMP4_ADC_SG2.20(IEXC1) STAMP4_ADC_TEMP.7(REFP1) STAMP4_ADC_TEMP.8(REFN1) STAMP4_ADC_TEMP.13(AIN4/IECG/GPIO4) STAMP4_ADC_TEMP.14(AIN5/IEXC/GPIO5) STAMP4_ADC_TEMP.15(AIN6/IEXC/GPIO6) STAMP4_ADC_TEMP.16(AIN7/IEXC/GPIO7) STAMP4_ADC_TEMP.19(IEXC2) STAMP4_ADC_TEMP.20(IEXC1)

### Notes on the sheet
- STAMP 4

## Sheet 7 of 8: STAMP 5
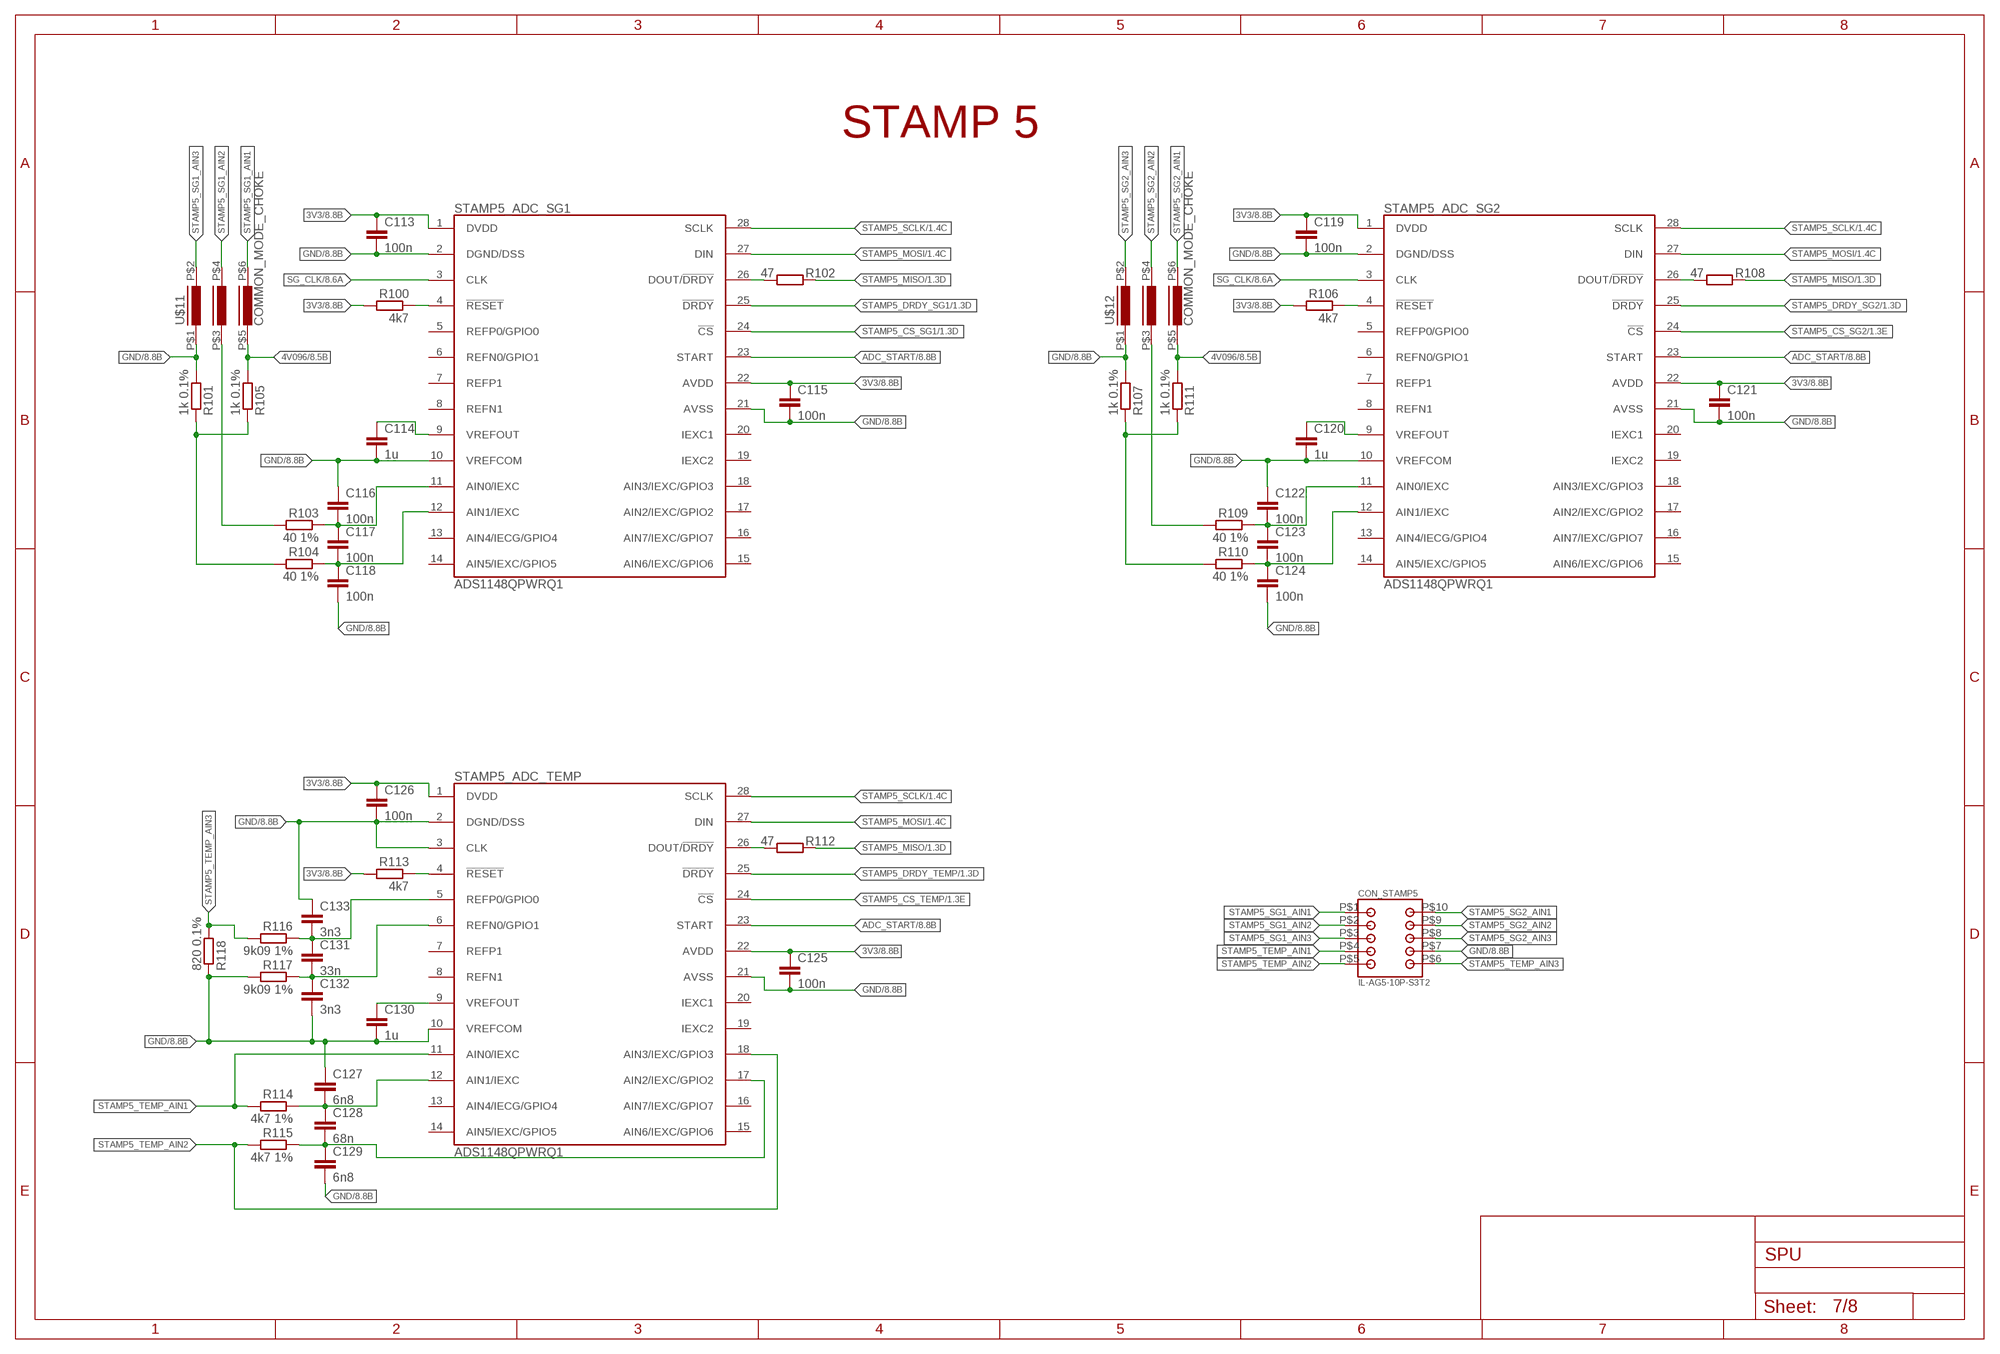
[diagram p6: schematic, sheet 7]

### Parts
C113  100n  C-EUC0805  [C0805]
C114  1u  C-EUC0805  [C0805]
C115  100n  C-EUC0805  [C0805]
C116  100n  C-EUC0805  [C0805]
C117  100n  C-EUC0805  [C0805]
C118  100n  C-EUC0805  [C0805]
C119  100n  C-EUC0805  [C0805]
C120  1u  C-EUC0805  [C0805]
C121  100n  C-EUC0805  [C0805]
C122  100n  C-EUC0805  [C0805]
C123  100n  C-EUC0805  [C0805]
C124  100n  C-EUC0805  [C0805]
C125  100n  C-EUC0805  [C0805]
C126  100n  C-EUC0805  [C0805]
C127  6n8  C-EUC0805  [C0805]
C128  68n  C-EUC0805  [C0805]
C129  6n8  C-EUC0805  [C0805]
C130  1u  C-EUC0805  [C0805]
C131  33n  C-EUC0805  [C0805]
C132  3n3  C-EUC0805  [C0805]
C133  3n3  C-EUC0805  [C0805]
CON_STAMP5  IL-AG5-10P-S3T2  [IL-AG5-10P-S3T2]
R100  4k7  R-EU_R0805  [R0805]
R101  1k 0.1%  R-EU_R0805  [R0805]
R102  47  R-EU_R0805  [R0805]
R103  40 1%  R-EU_R0805  [R0805]
R104  40 1%  R-EU_R0805  [R0805]
R105  1k 0.1%  R-EU_R0805  [R0805]
R106  4k7  R-EU_R0805  [R0805]
R107  1k 0.1%  R-EU_R0805  [R0805]
R108  47  R-EU_R0805  [R0805]
R109  40 1%  R-EU_R0805  [R0805]
R110  40 1%  R-EU_R0805  [R0805]
R111  1k 0.1%  R-EU_R0805  [R0805]
R112  47  R-EU_R0805  [R0805]
R113  4k7  R-EU_R0805  [R0805]
R114  4k7 1%  R-EU_R0805  [R0805]
R115  4k7 1%  R-EU_R0805  [R0805]
R116  9k09 1%  R-EU_R0805  [R0805]
R117  9k09 1%  R-EU_R0805  [R0805]
R118  820 0.1%  R-EU_R0805  [R0805]
STAMP5_ADC_SG1  ADS1148QPWRQ1  [TSSOP28]
STAMP5_ADC_SG2  ADS1148QPWRQ1  [TSSOP28]
STAMP5_ADC_TEMP  ADS1148QPWRQ1  [TSSOP28]
U$11  COMMON_MODE_CHOKE  [COMMON_MODE_CHOKE]
U$12  COMMON_MODE_CHOKE  [COMMON_MODE_CHOKE]

### Nets
3V3: C113.1 C115.1 C119.1 C121.1 C125.1 C126.1 R100.2 R106.2 R113.2 STAMP5_ADC_SG1.1(DVDD) STAMP5_ADC_SG1.22(AVDD) STAMP5_ADC_SG2.1(DVDD) STAMP5_ADC_SG2.22(AVDD) STAMP5_ADC_TEMP.1(DVDD) STAMP5_ADC_TEMP.22(AVDD) ; also sheet 1,2,3,4,5,6,8
4V096: R105.2 R111.2 U$11.P$5 U$12.P$5 ; also sheet 2,3,4,5,6,8
ADC_START: STAMP5_ADC_SG1.23(START) STAMP5_ADC_SG2.23(START) STAMP5_ADC_TEMP.23(START) ; also sheet 1,3,4,5,6,8
GND: C113.2 C114.2 C115.2 C116.1 C118.2 C119.2 C120.2 C121.2 C122.1 C124.2 C125.2 C126.2 C127.1 C129.2 C130.2 C132.2 C133.1 CON_STAMP5.P$7 R101.2 R107.2 R117.2 R118.1 STAMP5_ADC_SG1.2(DGND/DSS) STAMP5_ADC_SG1.10(VREFCOM) STAMP5_ADC_SG1.21(AVSS) STAMP5_ADC_SG2.2(DGND/DSS) STAMP5_ADC_SG2.10(VREFCOM) STAMP5_ADC_SG2.21(AVSS) STAMP5_ADC_TEMP.2(DGND/DSS) STAMP5_ADC_TEMP.3(CLK) STAMP5_ADC_TEMP.10(VREFCOM) STAMP5_ADC_TEMP.21(AVSS) U$11.P$1 U$12.P$1 ; also sheet 1,2,3,4,5,6,8
N$112: R100.1 STAMP5_ADC_SG1.4(!RESET)
N$113: C114.1 STAMP5_ADC_SG1.9(VREFOUT)
N$114: R102.2 STAMP5_ADC_SG1.26(DOUT/!DRDY)
N$115: C116.2 C117.1 R103.1 STAMP5_ADC_SG1.11(AIN0/IEXC)
N$116: C117.2 C118.1 R104.1 STAMP5_ADC_SG1.12(AIN1/IEXC)
N$117: R101.1 R104.2 R105.1
N$118: R103.2 U$11.P$3
N$119: R106.1 STAMP5_ADC_SG2.4(!RESET)
N$120: C120.1 STAMP5_ADC_SG2.9(VREFOUT)
N$121: R108.2 STAMP5_ADC_SG2.26(DOUT/!DRDY)
N$122: C122.2 C123.1 R109.1 STAMP5_ADC_SG2.11(AIN0/IEXC)
N$123: C123.2 C124.1 R110.1 STAMP5_ADC_SG2.12(AIN1/IEXC)
N$124: R107.1 R110.2 R111.1
N$125: R109.2 U$12.P$3
N$126: R112.2 STAMP5_ADC_TEMP.26(DOUT/!DRDY)
N$127: R113.1 STAMP5_ADC_TEMP.4(!RESET)
N$128: C127.2 C128.1 R114.1 STAMP5_ADC_TEMP.12(AIN1/IEXC)
N$129: C128.2 C129.1 R115.1 STAMP5_ADC_TEMP.17(AIN2/IEXC/GPIO2)
N$130: C130.1 STAMP5_ADC_TEMP.9(VREFOUT)
N$131: C131.2 C132.1 R117.1 STAMP5_ADC_TEMP.6(REFN0/GPIO1)
N$132: C131.1 C133.2 R116.1 STAMP5_ADC_TEMP.5(REFP0/GPIO0)
SG_CLK: STAMP5_ADC_SG1.3(CLK) STAMP5_ADC_SG2.3(CLK) ; also sheet 2,3,4,5,6,8
STAMP5_CS_SG1: STAMP5_ADC_SG1.24(!CS) ; also sheet 1
STAMP5_CS_SG2: STAMP5_ADC_SG2.24(!CS) ; also sheet 1
STAMP5_CS_TEMP: STAMP5_ADC_TEMP.24(!CS) ; also sheet 1
STAMP5_DRDY_SG1: STAMP5_ADC_SG1.25(!DRDY) ; also sheet 1
STAMP5_DRDY_SG2: STAMP5_ADC_SG2.25(!DRDY) ; also sheet 1
STAMP5_DRDY_TEMP: STAMP5_ADC_TEMP.25(!DRDY) ; also sheet 1
STAMP5_MISO: R102.1 R108.1 R112.1 ; also sheet 1
STAMP5_MOSI: STAMP5_ADC_SG1.27(DIN) STAMP5_ADC_SG2.27(DIN) STAMP5_ADC_TEMP.27(DIN) ; also sheet 1
STAMP5_SCLK: STAMP5_ADC_SG1.28(SCLK) STAMP5_ADC_SG2.28(SCLK) STAMP5_ADC_TEMP.28(SCLK) ; also sheet 1
STAMP5_SG1_AIN1: CON_STAMP5.P$1 U$11.P$6
STAMP5_SG1_AIN2: CON_STAMP5.P$2 U$11.P$4
STAMP5_SG1_AIN3: CON_STAMP5.P$3 U$11.P$2
STAMP5_SG2_AIN1: CON_STAMP5.P$10 U$12.P$6
STAMP5_SG2_AIN2: CON_STAMP5.P$9 U$12.P$4
STAMP5_SG2_AIN3: CON_STAMP5.P$8 U$12.P$2
STAMP5_TEMP_AIN1: CON_STAMP5.P$4 R114.2 STAMP5_ADC_TEMP.11(AIN0/IEXC)
STAMP5_TEMP_AIN2: CON_STAMP5.P$5 R115.2 STAMP5_ADC_TEMP.18(AIN3/IEXC/GPIO3)
STAMP5_TEMP_AIN3: CON_STAMP5.P$6 R116.2 R118.2
Unconnected: STAMP5_ADC_SG1.5(REFP0/GPIO0) STAMP5_ADC_SG1.6(REFN0/GPIO1) STAMP5_ADC_SG1.7(REFP1) STAMP5_ADC_SG1.8(REFN1) STAMP5_ADC_SG1.13(AIN4/IECG/GPIO4) STAMP5_ADC_SG1.14(AIN5/IEXC/GPIO5) STAMP5_ADC_SG1.15(AIN6/IEXC/GPIO6) STAMP5_ADC_SG1.16(AIN7/IEXC/GPIO7) STAMP5_ADC_SG1.17(AIN2/IEXC/GPIO2) STAMP5_ADC_SG1.18(AIN3/IEXC/GPIO3) STAMP5_ADC_SG1.19(IEXC2) STAMP5_ADC_SG1.20(IEXC1) STAMP5_ADC_SG2.5(REFP0/GPIO0) STAMP5_ADC_SG2.6(REFN0/GPIO1) STAMP5_ADC_SG2.7(REFP1) STAMP5_ADC_SG2.8(REFN1) STAMP5_ADC_SG2.13(AIN4/IECG/GPIO4) STAMP5_ADC_SG2.14(AIN5/IEXC/GPIO5) STAMP5_ADC_SG2.15(AIN6/IEXC/GPIO6) STAMP5_ADC_SG2.16(AIN7/IEXC/GPIO7) STAMP5_ADC_SG2.17(AIN2/IEXC/GPIO2) STAMP5_ADC_SG2.18(AIN3/IEXC/GPIO3) STAMP5_ADC_SG2.19(IEXC2) STAMP5_ADC_SG2.20(IEXC1) STAMP5_ADC_TEMP.7(REFP1) STAMP5_ADC_TEMP.8(REFN1) STAMP5_ADC_TEMP.13(AIN4/IECG/GPIO4) STAMP5_ADC_TEMP.14(AIN5/IEXC/GPIO5) STAMP5_ADC_TEMP.15(AIN6/IEXC/GPIO6) STAMP5_ADC_TEMP.16(AIN7/IEXC/GPIO7) STAMP5_ADC_TEMP.19(IEXC2) STAMP5_ADC_TEMP.20(IEXC1)

### Notes on the sheet
- STAMP 5